# EAGLE design Joystick (EAGLE 9.6.0)
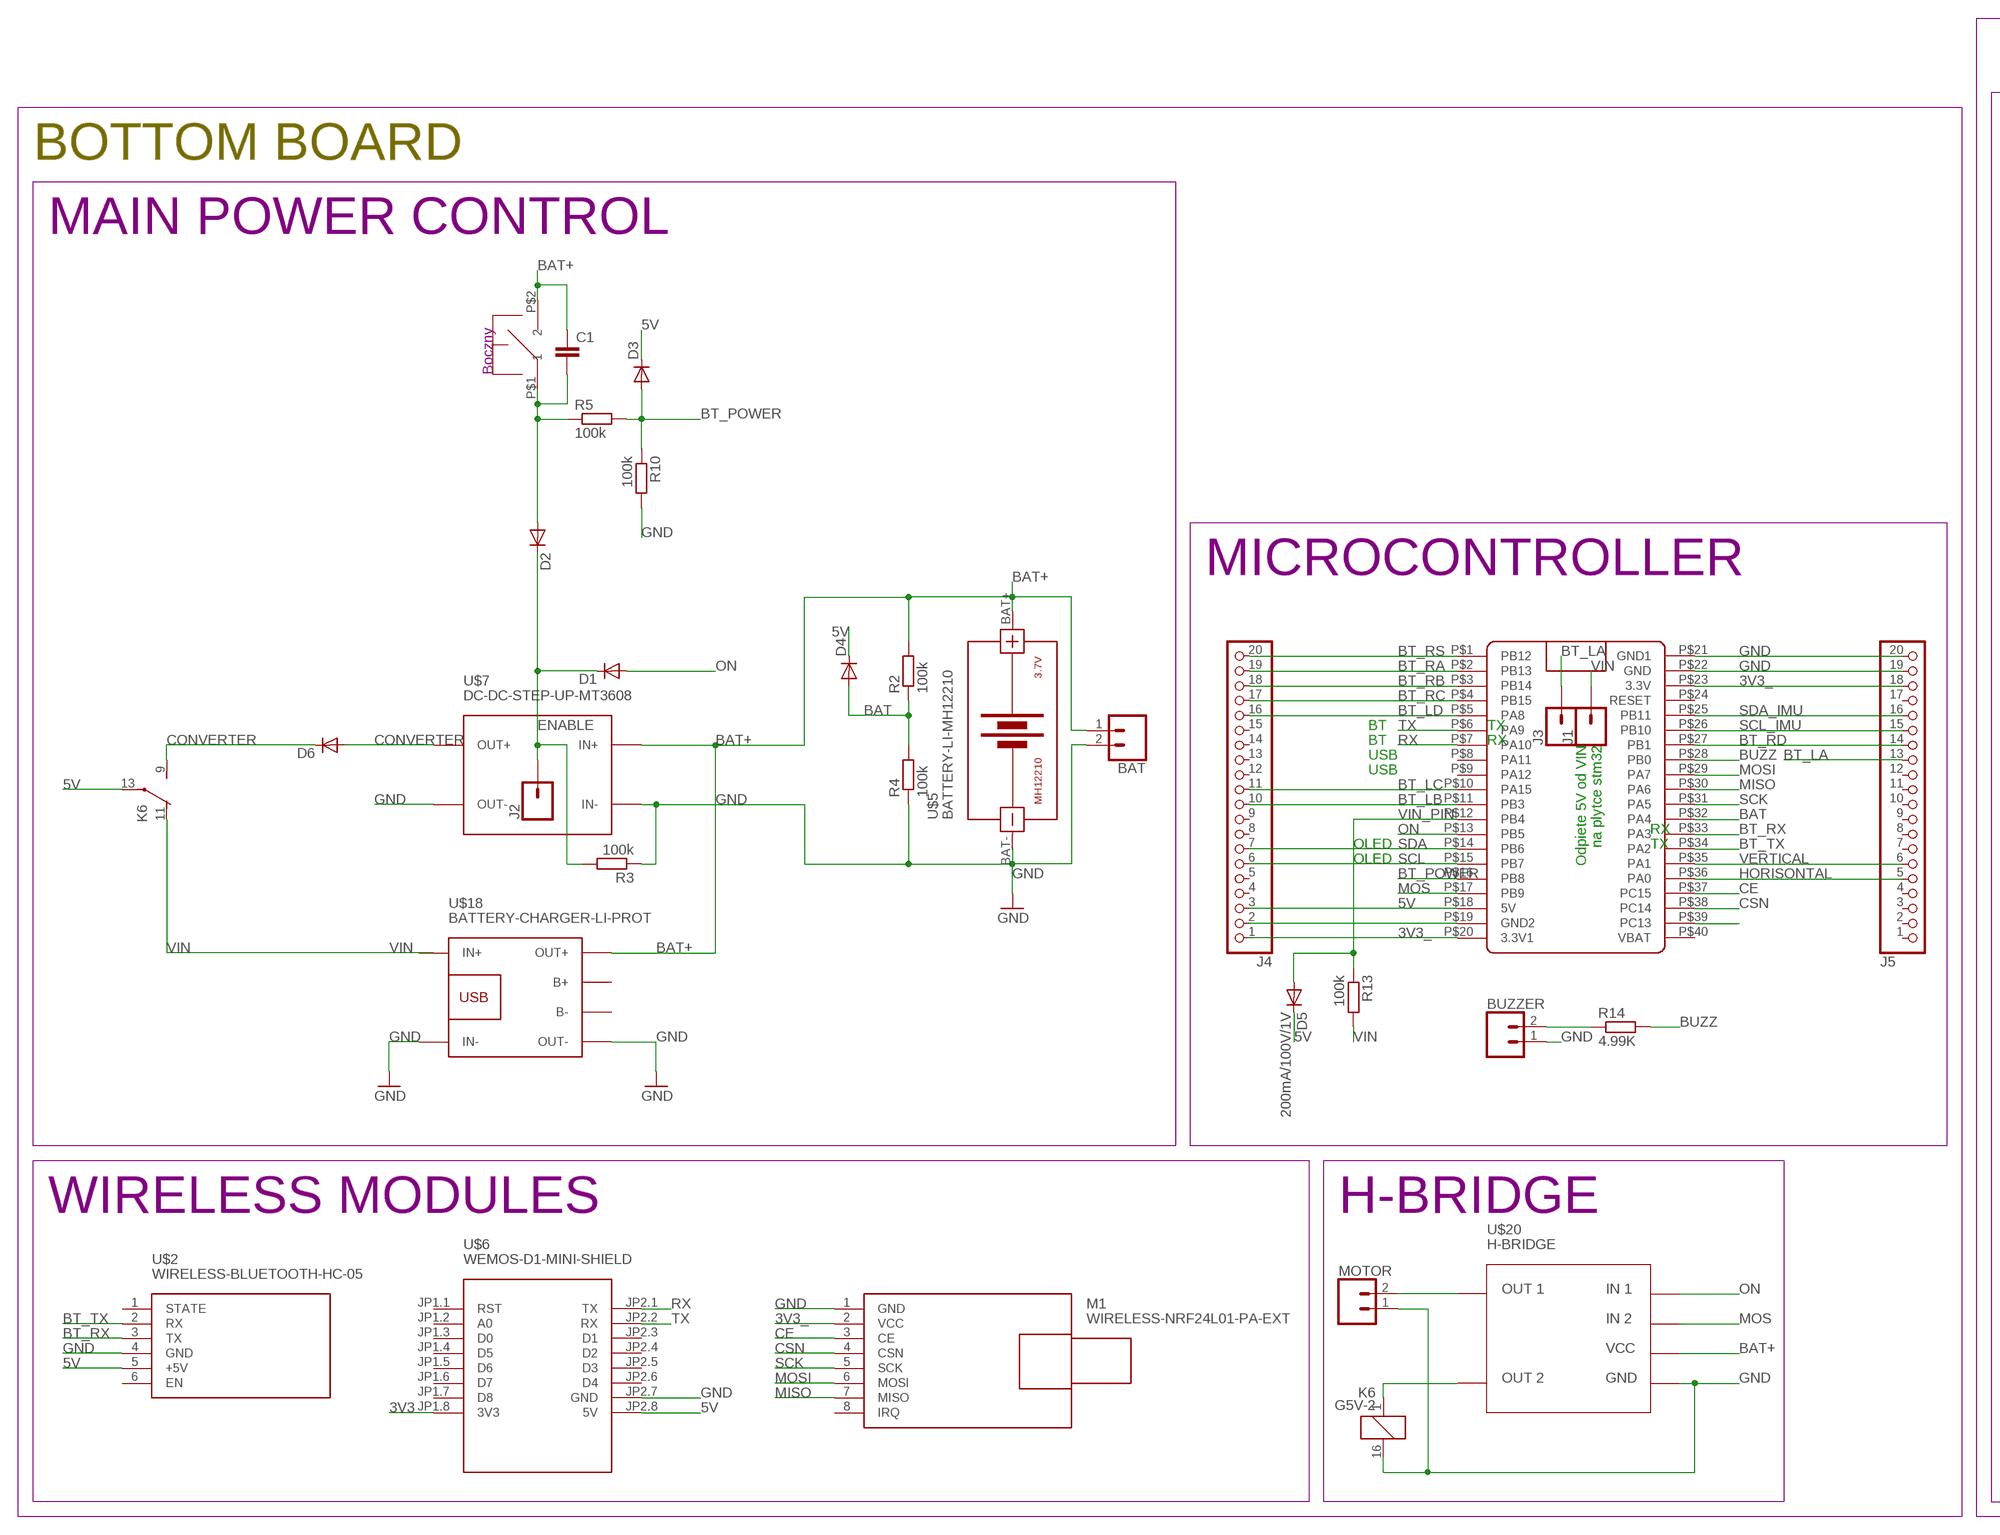
[diagram p0: schematic, sheet 1, part 1 of 2]
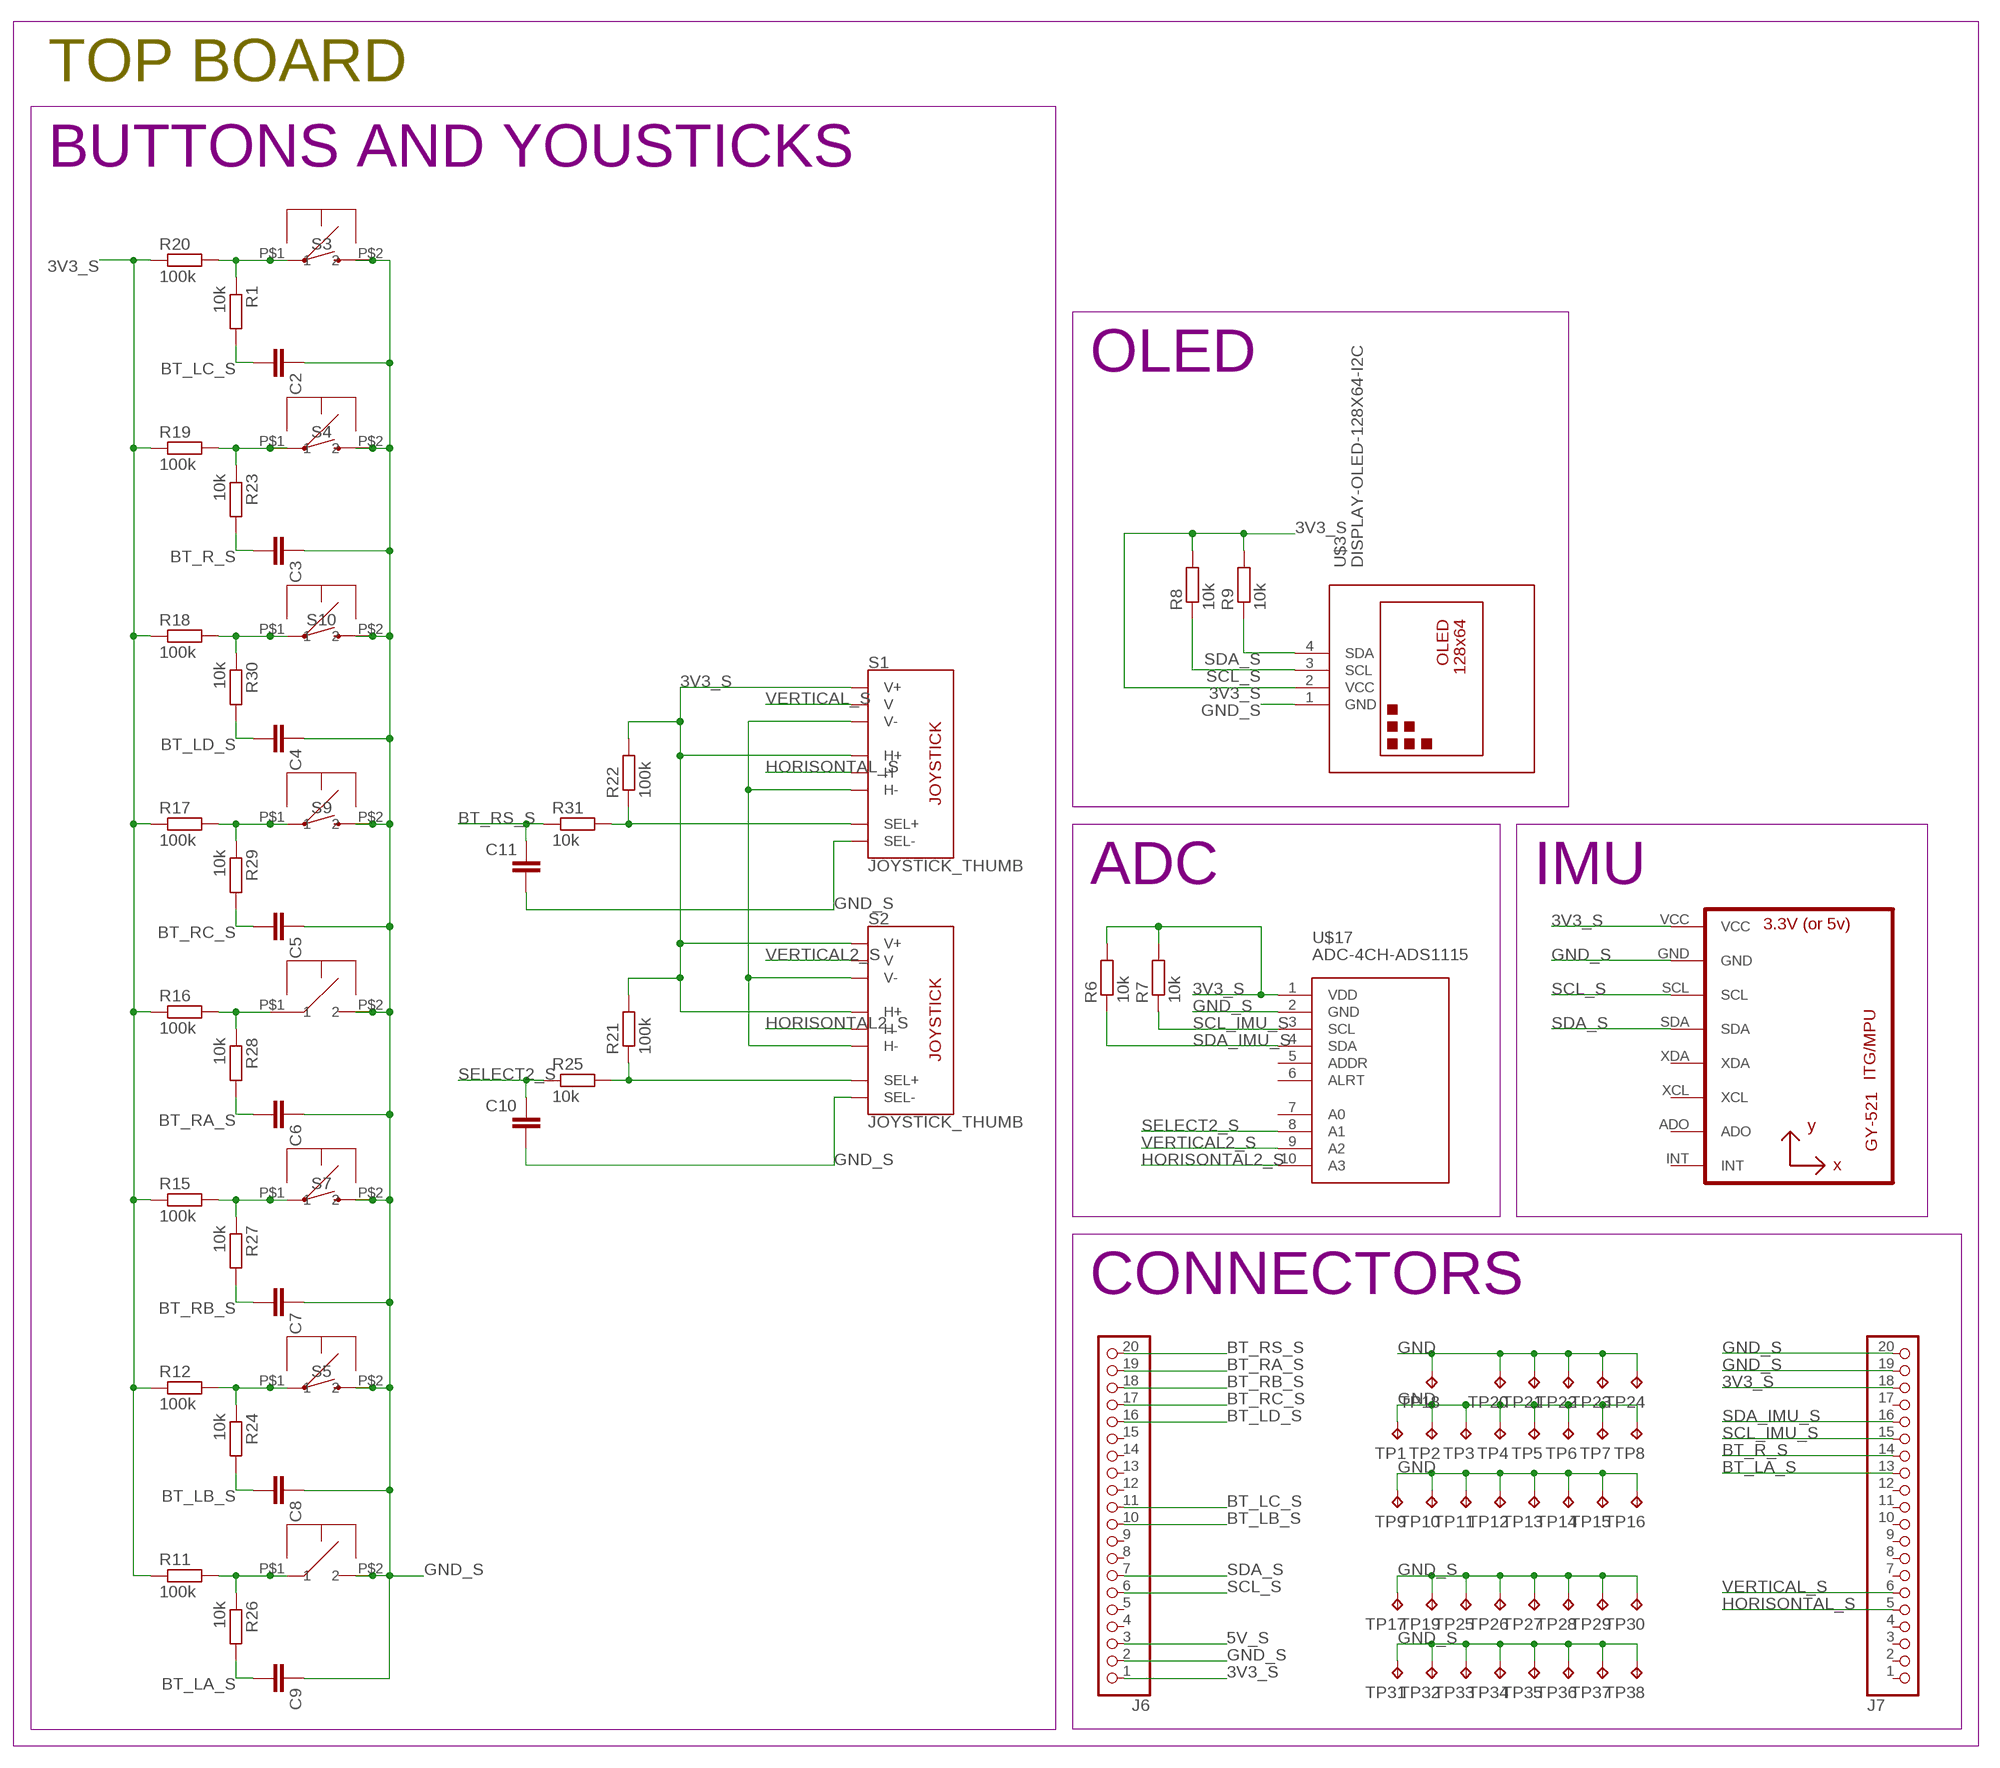
[diagram p1: schematic, sheet 1, part 2 of 2]

## Parts
BAT  CONN_02  [1X02]
BUZZER  CONN_02  [1X02]
C1  C-EUC1206  [C1206]
C2  C-EUC1206  [C1206]
C3  C-EUC1206  [C1206]
C4  C-EUC1206  [C1206]
C5  C-EUC1206  [C1206]
C6  C-EUC1206  [C1206]
C7  C-EUC1206  [C1206]
C8  C-EUC1206  [C1206]
C9  C-EUC1206  [C1206]
C10  C-EUC1206  [C1206]
C11  C-EUC1206  [C1206]
D1  200mA/100V/1V  DIODE-DO214AC  [DO214AC]
D2  200mA/100V/1V  DIODE-DO214AC  [DO214AC]
D3  200mA/100V/1V  DIODE-DO214AC  [DO214AC]
D4  200mA/100V/1V  DIODE-DO214AC  [DO214AC]
D5  200mA/100V/1V  DIODE-DO214AC  [DO214AC]
D6  200mA/100V/1V  DIODE-DO214AC  [DO214AC]
J1  CONN_01  [1X01]
J2  CONN_01  [1X01]
J3  CONN_01  [1X01]
J4  PINHD-1X20  [1X20]
J5  PINHD-1X20  [1X20]
J6  PINHD-1X20  [1X20]
J7  PINHD-1X20  [1X20]
K6  G5V-2  [G5V-2]
M1  WIRELESS-NRF24L01-PA-EXT  [WIRELESS-NRF24L01-PA-EXT]
MOTOR  CONN_02  [1X02]
R1  10k  R-EU_R0805  [R0805]
R2  100k  R-EU_R0805  [R0805]
R3  100k  R-EU_R0805  [R0805]
R4  100k  R-EU_R0805  [R0805]
R5  100k  R-EU_R0805  [R0805]
R6  10k  R-EU_R0805  [R0805]
R7  10k  R-EU_R0805  [R0805]
R8  10k  R-EU_R0805  [R0805]
R9  10k  R-EU_R0805  [R0805]
R10  100k  R-EU_R0805  [R0805]
R11  100k  R-EU_R0805  [R0805]
R12  100k  R-EU_R0805  [R0805]
R13  100k  R-EU_R0805  [R0805]
R14  4.99K  R-EU_R0805  [R0805]
R15  100k  R-EU_R0805  [R0805]
R16  100k  R-EU_R0805  [R0805]
R17  100k  R-EU_R0805  [R0805]
R18  100k  R-EU_R0805  [R0805]
R19  100k  R-EU_R0805  [R0805]
R20  100k  R-EU_R0805  [R0805]
R21  100k  R-EU_R0805  [R0805]
R22  100k  R-EU_R0805  [R0805]
R23  10k  R-EU_R0805  [R0805]
R24  10k  R-EU_R0805  [R0805]
R25  10k  R-EU_R0805  [R0805]
R26  10k  R-EU_R0805  [R0805]
R27  10k  R-EU_R0805  [R0805]
R28  10k  R-EU_R0805  [R0805]
R29  10k  R-EU_R0805  [R0805]
R30  10k  R-EU_R0805  [R0805]
R31  10k  R-EU_R0805  [R0805]
S1  JOYSTICK_THUMB  [JOYSTICK]
S2  JOYSTICK_THUMB  [JOYSTICK]
S3  MOMENTARY-SWITCH-SPST-PTH-12MM  [TACTILE_SWITCH_PTH_12MM]
S4  MOMENTARY-SWITCH-SPST-PTH-12MM  [TACTILE_SWITCH_PTH_12MM]
S5  MOMENTARY-SWITCH-SPST-PTH-12MM  [TACTILE_SWITCH_PTH_12MM]
S7  MOMENTARY-SWITCH-SPST-PTH-12MM  [TACTILE_SWITCH_PTH_12MM]
S9  MOMENTARY-SWITCH-SPST-PTH-12MM  [TACTILE_SWITCH_PTH_12MM]
S10  MOMENTARY-SWITCH-SPST-PTH-12MM  [TACTILE_SWITCH_PTH_12MM]
TP1  TPB1,27  [B1,27]
TP2  TPB1,27  [B1,27]
TP3  TPB1,27  [B1,27]
TP4  TPB1,27  [B1,27]
TP5  TPB1,27  [B1,27]
TP6  TPB1,27  [B1,27]
TP7  TPB1,27  [B1,27]
TP8  TPB1,27  [B1,27]
TP9  TPB1,27  [B1,27]
TP10  TPB1,27  [B1,27]
TP11  TPB1,27  [B1,27]
TP12  TPB1,27  [B1,27]
TP13  TPB1,27  [B1,27]
TP14  TPB1,27  [B1,27]
TP15  TPB1,27  [B1,27]
TP16  TPB1,27  [B1,27]
TP17  TPB1,27  [B1,27]
TP18  TPB1,27  [B1,27]
TP19  TPB1,27  [B1,27]
TP20  TPB1,27  [B1,27]
TP21  TPB1,27  [B1,27]
TP22  TPB1,27  [B1,27]
TP23  TPB1,27  [B1,27]
TP24  TPB1,27  [B1,27]
TP25  TPB1,27  [B1,27]
TP26  TPB1,27  [B1,27]
TP27  TPB1,27  [B1,27]
TP28  TPB1,27  [B1,27]
TP29  TPB1,27  [B1,27]
TP30  TPB1,27  [B1,27]
TP31  TPB1,27  [B1,27]
TP32  TPB1,27  [B1,27]
TP33  TPB1,27  [B1,27]
TP34  TPB1,27  [B1,27]
TP35  TPB1,27  [B1,27]
TP36  TPB1,27  [B1,27]
TP37  TPB1,27  [B1,27]
TP38  TPB1,27  [B1,27]
U1  GY-521MPU6050  [GY-521]
U$1  BLUE_PILL  [BLUE_PILL]
U$2  WIRELESS-BLUETOOTH-HC-05  [WIRELESS-BLUETOOTH-HC-05]
U$3  DISPLAY-OLED-128X64-I2C  [DISPLAY-OLED-128X64-I2C]
U$4  MOUSE_BT  [MOUSE_BT]
U$5  BATTERY-LI-MH12210  [BATTERY-LI-MH12210]
U$6  WEMOS-D1-MINI-SHIELD  [WEMOS-D1-MINI-SHIELD]
U$7  DC-DC-STEP-UP-MT3608  [DC-DC-STEP-UP-MT3608]
U$8  MOUSE_BT  [MOUSE_BT]
U$9  MOUSE_BT  [MOUSE_BT]
U$10  MOUSE_BT  [MOUSE_BT]
U$11  MOUSE_BT  [MOUSE_BT]
U$12  MOUSE_BT  [MOUSE_BT]
U$13  MOUSE_BT  [MOUSE_BT]
U$14  MOUSE_BT  [MOUSE_BT]
U$16  MOUSE_BT  [MOUSE_BT]
U$17  ADC-4CH-ADS1115  [ADC-4CH-ADS1115]
U$18  BATTERY-CHARGER-LI-PROT  [BATTERY-CHARGER-LI-PROT]

## Nets
3V3: U$6.JP1.8(3V3)
3V3_: J4.1 J5.18 M1.2(VCC) U$1.P$20(3.3V1) U$1.P$23(3.3V)
3V3_S: J6.1 J7.18 R6.2 R7.2 R8.2 R9.2 R11.1 R12.1 R15.1 R16.1 R17.1 R18.1 R19.1 R20.1 R21.2 R22.2 S1.H1(H+) S1.V1(V+) S2.H1(H+) S2.V1(V+) U1.VCC U$3.2(VCC) U$17.1(VDD)
5V: D3.C D4.C D5.C J4.3 K6.13(2:P) U$1.P$18(5V) U$2.5(+5V) U$6.JP2.8(5V)
5V_S: J6.3
ASD: BUZZER.2 R14.1
BAT: D4.A R2.1 R4.2 U$1.P$32(PA4)
BAT+: BAT.1 C1.1 R2.2 U$5.BAT+ U$7.IN+ U$8.P$2 U$18.OUT+
BT_LA: J3.1 J5.13
BT_LA_S: C9.2 J7.13 R26.2
BT_LB: J4.10 U$1.P$11(PB3)
BT_LB_S: C8.2 J6.10 R24.2
BT_LC: J4.11 U$1.P$10(PA15)
BT_LC_S: C2.2 J6.11 R1.2
BT_LD: J4.16 U$1.P$5(PA8)
BT_LD_S: C4.2 J6.16 R30.2
BT_POWER: D3.A R5.2 R10.1 U$1.P$16(PB8)
BT_R_S: C3.2 J7.14 R23.2
BT_RA: J4.19 U$1.P$2(PB13)
BT_RA_S: C6.2 J6.19 R28.2
BT_RB: J4.18 U$1.P$3(PB14)
BT_RB_S: C7.2 J6.18 R27.2
BT_RC: J4.17 U$1.P$4(PB15)
BT_RC_S: C5.2 J6.17 R29.2
BT_RD: J5.14 U$1.P$27(PB1)
BT_RS: J4.20 U$1.P$1(PB12)
BT_RS_S: C11.1 J6.20 R31.1
BT_RX: U$1.P$33(PA3) U$2.3(TX)
BT_TX: U$1.P$34(PA2) U$2.2(RX)
BUTTON: C1.2 D2.A R5.1 U$8.P$1
BUZZ: R14.2 U$1.P$28(PB0)
CE: M1.3(CE) U$1.P$37(PC15)
CONVERTER: D6.C K6.9(2:S)
CSN: M1.4(CSN) U$1.P$38(PC14)
ENABLE: D1.C D2.C J2.1 R3.2
GGJHGJ: U$1.P$39(PC13)
GND: BAT.2 BUZZER.1 J4.2 J5.19 J5.20 K6.16 M1.1(GND) MOTOR.1 R3.1 R4.1 R10.2 TP1.TP TP2.TP TP3.TP TP4.TP TP5.TP TP6.TP TP7.TP TP8.TP TP9.TP TP10.TP TP11.TP TP12.TP TP13.TP TP14.TP TP15.TP TP16.TP TP18.TP TP20.TP TP21.TP TP22.TP TP23.TP TP24.TP U$1.P$19(GND2) U$1.P$21(GND1) U$1.P$22(GND) U$2.4(GND) U$5.BAT- U$6.JP2.7(GND) U$7.IN- U$7.OUT- U$18.IN- U$18.OUT-
GND_S: C2.1 C3.1 C4.1 C5.1 C6.1 C7.1 C8.1 C9.1 C10.2 C11.2 J6.2 J7.19 J7.20 S1.B2A(SEL-) S1.H3(H-) S1.V3(V-) S2.B2A(SEL-) S2.H3(H-) S2.V3(V-) S3.3 S4.3 S5.3 S7.3 S9.3 S10.3 TP17.TP TP19.TP TP25.TP TP26.TP TP27.TP TP28.TP TP29.TP TP30.TP TP31.TP TP32.TP TP33.TP TP34.TP TP35.TP TP36.TP TP37.TP TP38.TP U1.GND U$3.1(GND) U$4.P$2 U$9.P$2 U$10.P$2 U$11.P$2 U$12.P$2 U$13.P$2 U$14.P$2 U$16.P$2 U$17.2(GND)
HORISONTAL: J5.5 U$1.P$36(PA0)
HORISONTAL2_S: S2.H2(H) U$17.10(A3)
HORISONTAL_S: J7.5 S1.H2(H)
MISO: M1.7(MISO) U$1.P$30(PA6)
MOS: U$1.P$17(PB9)
MOSI: M1.6(MOSI) U$1.P$29(PA7)
N$1: D6.A U$7.OUT+
N$2: R1.1 R20.2 S3.1 U$10.P$1
N$3: R19.2 R23.1 S4.1 U$4.P$1
N$4: MOTOR.2
N$5: R21.1 R25.2 S2.B1A(SEL+)
N$6: R12.2 R24.1 S5.1 U$11.P$1
N$7: R11.2 R26.1 U$9.P$1
N$8: R18.2 R30.1 S10.1 U$16.P$1
N$9: R17.2 R29.1 S9.1 U$14.P$1
N$10: R16.2 R28.1 U$12.P$1
N$11: R15.2 R27.1 S7.1 U$13.P$1
N$12: R22.1 R31.2 S1.B1A(SEL+)
N$13: K6.1
ON: D1.A U$1.P$13(PB5)
RX: U$1.P$7(PA10) U$6.JP2.1(TX)
SCK: M1.5(SCK) U$1.P$31(PA5)
SCL: J4.6 U$1.P$15(PB7)
SCL_IMU: J5.15 U$1.P$26(PB10)
SCL_IMU_S: J7.15 R7.1 U$17.3(SCL)
SCL_S: J6.6 R8.1 U1.SCL U$3.3(SCL)
SDA: J4.7 U$1.P$14(PB6)
SDA_IMU: J5.16 U$1.P$25(PB11)
SDA_IMU_S: J7.16 R6.1 U$17.4(SDA)
SDA_S: J6.7 R9.1 U1.SDA U$3.4(SDA)
SELECT2_S: C10.1 R25.1 U$17.8(A1)
TX: U$1.P$6(PA9) U$6.JP2.2(RX)
VERTICAL: J5.6 U$1.P$35(PA1)
VERTICAL2_S: S2.V2(V) U$17.9(A2)
VERTICAL_S: J7.6 S1.V2(V)
VIN: J1.1 K6.11(2:O) R13.2 U$18.IN+
VIN_PIN: D5.A R13.1 U$1.P$12(PB4)
Unconnected: J4.4 J4.5 J4.8 J4.9 J4.12 J4.13 J4.14 J4.15 J5.1 J5.2 J5.3 J5.4 J5.7 J5.8 J5.9 J5.10 J5.11 J5.12 J5.17 J6.4 J6.5 J6.8 J6.9 J6.12 J6.13 J6.14 J6.15 J7.1 J7.2 J7.3 J7.4 J7.7 J7.8 J7.9 J7.10 J7.11 J7.12 J7.17 K6.4(1:P) K6.6(1:O) K6.8(1:S) M1.8(IRQ) U1.ADO U1.INT U1.XCL U1.XDA U$1.P$8(PA11) U$1.P$9(PA12) U$1.P$24(RESET) U$1.P$40(VBAT) U$2.1(STATE) U$2.6(EN) U$6.JP1.1(RST) U$6.JP1.2(A0) U$6.JP1.3(D0) U$6.JP1.4(D5) U$6.JP1.5(D6) U$6.JP1.6(D7) U$6.JP1.7(D8) U$6.JP2.3(D1) U$6.JP2.4(D2) U$6.JP2.5(D3) U$6.JP2.6(D4) U$17.5(ADDR) U$17.6(ALRT) U$17.7(A0) U$18.B+ U$18.B-

## Notes on the sheet
- TOP BOARD
- BOTTOM BOARD | BUTTONS AND YOUSTICKS
- MAIN POWER CONTROL
- OLED
- Boczny
- MICROCONTROLLER
- BT | TX | ADC | IMU
- BT | RX
- Odpiete 5V od VIN
  na plytce stm32
- USB
- USB
- RX
- OLED | TX
- OLED
- CONNECTORS
- WIRELESS MODULES | H-BRIDGE
- U$20
- H-BRIDGE
- OUT 1 | IN 1
- IN 2
- VCC
- OUT 2 | GND

## Library data of the parts
BAT BUZZER MOTOR = SparkFun-Connectors:CONN_02: Multi connection point. Often used as Generic Header-pin footprint for 0.1 inch spaced/style header connections On any of the 0.1 inch spaced packages, you can populate with these: Break Away Headers - Straight <https://www.sparkfun.com/products/116> (PRT-00116) Break Away Male Headers - Right Angle <https://www.sparkfun.com/products/553> (PRT-00553) Female Headers <https://www.sparkfun.com/products/115> (PRT-00115) Break Away Headers - Machine Pin <https://www.sparkfun.com/products/117> (PRT-00117) Break Away Female Headers - Swiss Machine Pin <https://www.sparkfun.com/products/743> (PRT-00743) For SCREWTERMINALS and SPRING TERMINALS visit here: Screw Terimnals on SparkFun.com <https://www.sparkfun.com/search/results?term=Screw+Terminals> (5mm/3.5mm/2.54mm spacing) This device is also useful as a general connection point to wire up your design to another part of your project. Our various solder wires solder well into these plated through hole pads. Hook-Up Wire - Assortment (Stranded, 22 AWG) <https://www.sparkfun.com/products/11375> (PRT-11375) Hook-Up Wire - Assortment (Solid Core, 22 AWG) <https://www.sparkfun.com/products/11367> (PRT-11367) View the entire wire category on our website here <https://www.sparkfun.com/categories/141> Special notes: Molex polarized connector foot print use with: PRT-08233 with associated crimp pins and housings. 2.54_SCREWTERM for use with PRT-10571. 3.5mm Screw Terminal footprints for PRT-08084 5mm Screw Terminal footprints for use with PRT-08432
C1-C11 = rcl:C-EU: CAPACITOR, European symbol; SPICEPREFIX: C
D1-D6 = diode:DIODE-: DIODE
J1-J3 = SparkFun-Connectors:CONN_01: Single connection point. Often used as Generic Header-pin footprint for 0.1 inch spaced/style header connections On any of the 0.1 inch spaced packages, you can populate with these: Break Away Headers - Straight <https://www.sparkfun.com/products/116> (PRT-00116) Break Away Male Headers - Right Angle <https://www.sparkfun.com/products/553> (PRT-00553) Female Headers <https://www.sparkfun.com/products/115> (PRT-00115) Break Away Headers - Machine Pin <https://www.sparkfun.com/products/117> (PRT-00117) Break Away Female Headers - Swiss Machine Pin <https://www.sparkfun.com/products/743> (PRT-00743) This device is also useful as a general connection point to wire up your design to another part of your project. Our various solder wires solder well into these plated through hole pads. Hook-Up Wire - Assortment (Stranded, 22 AWG) <https://www.sparkfun.com/products/11375> (PRT-11375) Hook-Up Wire - Assortment (Solid Core, 22 AWG) <https://www.sparkfun.com/products/11367> (PRT-11367) View the entire wire category on our website here <https://www.sparkfun.com/categories/141> Special notes: SMTSO-256-ET is a "flush mount" nut for a 4-40 screw. We mostly use this on specialty testbeds; it is a nice way to connect hardware to your PCB at an adjustable hieght. Also note, the SNAP packages are for using a snappable style connector. We sell a baggie of snaps and they are also used on two LilyPad designs: Snap Assortment - 30 pack (male and female) <https://www.sparkfun.com/products/11347> (DEV-11347) LilyPad Arduino SimpleSnap <https://www.sparkfun.com/products/10941> (DEV-10941) LilyPad SimpleSnap Protoboard <https://www.sparkfun.com/products/10940> (DEV-10940)
J4-J7 = adafruit:PINHD-1X20: PIN HEADER
K6 = relay:G5V-2: OMRON PCB Relay Source: http://www.omron.com/ecb/products/pdf/en-g5v2.pdf; MPN: G5V-2 5DC; OC_FARNELL: 9949488; OC_NEWARK: 78K5703
M1 = diy-modules:WIRELESS-NRF24L01-PA-EXT: 2.4 GHz Wireless Module based on NRF24L01 chip with preamplifier and external antenna Click here to find device on ebay.com <http://www.ebay.com/sch/nrf24l01+pa+lna+sma>
R1-R31 = rcl:R-EU_: RESISTOR, European symbol; SPICEPREFIX: R
S1 S2 = SparkFun-Switches:JOYSTICK_THUMB: Analog Thumb Joystick This is a joystick very similar to the ‘analog’ joysticks on PS2 (PlayStation 2) controllers. Directional movements are simply two potentiometers - one for each axis. Pots are ~10k each. This joystick also has a select button that is actuated when the joystick is pressed down. SparkFun Products Thumb Joystick <https://www.sparkfun.com/products/9032> (COM-09032) SparkFun Thumb Joystick Breakout <https://www.sparkfun.com/products/9110> (BOB-09110) SparkFun Joystick Shield Kit <https://www.sparkfun.com/products/9760> (DEV-09760); PROD_ID: COMP-09744; SF_SKU: COM-09032
S3-S5 S7 S9 S10 = SparkFun-Switches:MOMENTARY-SWITCH-SPST: Momentary Switch (Pushbutton) - SPST Normally-open (NO) SPST momentary switches (buttons, pushbuttons). Variants PTH-12MM - 12mm square, through-hole Momentary Pushbutton Switch - 12mm Square <https://www.sparkfun.com/products/9190> (COM-09190) PTH-6.0MM, PTH-6.0MM-KIT - 6.0mm square, through-hole Mini Pushbutton Switch <https://www.sparkfun.com/products/97> (COM-00097) KIT package intended for soldering kit's - only one side of pads' copper is exposed. PTH-RIGHT-ANGLE-KIT - Right-angle, through-hole Right Angle Tactile Button <https://www.sparkfun.com/products/10791> - Used on SparkFun BigTime Watch Kit <https://www.sparkfun.com/products/11734> SMD-12MM - 12mm square, surface-mount Tactile Button - SMD (12mm) <https://www.sparkfun.com/products/12993> (COM-12993) Used on SparkFun PicoBoard <https://www.sparkfun.com/products/11888> SMD-4.5MM - 4.5mm Square Trackball Switch Used on SparkFun Blackberry Trackballer Breakout <https://www.sparkfun.com/products/13169> SMD-4.6MMX2.8MM - 4.60mm x 2.80mm, surface mount Used on SparkFun SAMD21 Mini Breakout <https://www.sparkfun.com/products/13664> SMD-5.2MM, SMD-5.2-REDUNDANT - 5.2mm square, surface-mount Mini Pushbutton Switch - SMD <https://www.sparkfun.com/products/8720> (COM-08720) Used on Arduino Pro Mini <https://www.sparkfun.com/products/11114> REDUNDANT package connects both switch circuits together SMD-6.0X3.5MM - 6.0 x 3.5mm, surface mount Momentary Reset Switch SMD <https://www.sparkfun.com/products/8229> (COM-08229) SMD-6.2MM-TALL - 6.2mm square, surface mount Tactile Button - SMD (6mm) <https://www.sparkfun.com/products/12992> Used on SparkFun Digital Sandbox <https://www.sparkfun.com/products/12651> SMD-RIGHT-ANGLE - Right-angle, surface mount Used on SparkFun Block for Intel® Edison - Arduino <https://www.sparkfun.com/products/13036>; PROD_ID: SWCH-09185; SF_SKU: COM-09190
TP1-TP38 = testpad:TP: Test pad
U1 = gy-521:GY-521
U$1 = BluePill:BLUE_PILL
U$2 = diy-modules:WIRELESS-BLUETOOTH-HC-05: Bluetooth Transceiver Module based on HC-05 board Tutorial is available here: https://arduino-info.wikispaces.com/BlueTooth-HC05-HC06-Modules-How-To Click here to find device on ebay.com <http://www.ebay.com/sch/hc-05+module+rs232>
U$3 = diy-modules:DISPLAY-OLED-128X64-I2C: 128x64 Dot Matrix OLED Module based on SSD1306 chip Variant with I2C interface More details available here: http://www.instructables.com/id/Monochrome-096-i2c-OLED-display-with-arduino-SSD13/ SSD1306 datasheet: https://cdn-shop.adafruit.com/datasheets/SSD1306.pdf Click here to find device on ebay.com <http://www.ebay.com/sch/oled+display+128x64+iic> Note: There are two variants: I2C and SPI. Search for the proper version.
U$4 U$8-U$14 U$16 = MOUSE_BT:MOUSE_BT
U$5 = diy-modules:BATTERY-LI-MH12210: Lithium-Ion MH12210 Rechargeable Battery Panasonic NCR18650PF battery datasheet available here: https://industrial.panasonic.com/cdbs/www-data/pdf2/ACI4000/ACI4000C12.pdf Click here to find device on ebay.com <http://www.ebay.com/sch/ncr18650b+battery>
U$6 = diy-modules:WEMOS-D1-MINI-SHIELD: Template for WEMOS D1 mini compatible shields NOTICE: This is a template only. You can use it as a base to create symbols for WEMOS D1 mini compatible shields. Official list of available shields can be found here: https://www.wemos.cc/D1-mini-Shields
U$7 = diy-modules:DC-DC-STEP-UP-MT3608: DC/DC Step-Up Regulator based on MT3608 chip MT3608 datasheet available here: https://www.olimex.com/Products/Breadboarding/BB-PWR-3608/resources/MT3608.pdf Click here to find device on ebay.com <http://www.ebay.com/sch/mt3608+module>
U$17 = diy-modules:ADC-4CH-ADS1115: 4 Channel 16-Bit Analog-to-Digital Converter based on ADS1115 chip Arduino ADS1115 Getting Started Tutorial is available here: http://henrysbench.capnfatz.com/henrys-bench/arduino-voltage-measurements/arduino-ads1115-module-getting-started-tutorial/ ADS1115 datasheet is available here: http://www.ti.com/lit/ds/symlink/ads1115.pdf Click here to find device on ebay.com <http://www.ebay.com/sch/ads1115+module>
U$18 = diy-modules:BATTERY-CHARGER-LI-PROT: Lithium Battery 5V Charger with protection circuit More details available here: http://www.instructables.com/id/DIY-Lithium-ion-Battery-Charger/step4/TP4056-based-lithium-ion-battery-charger-module/ Click here to find device on ebay.com <http://www.ebay.com/sch/tp4056+charger+usb+protection>

## Board
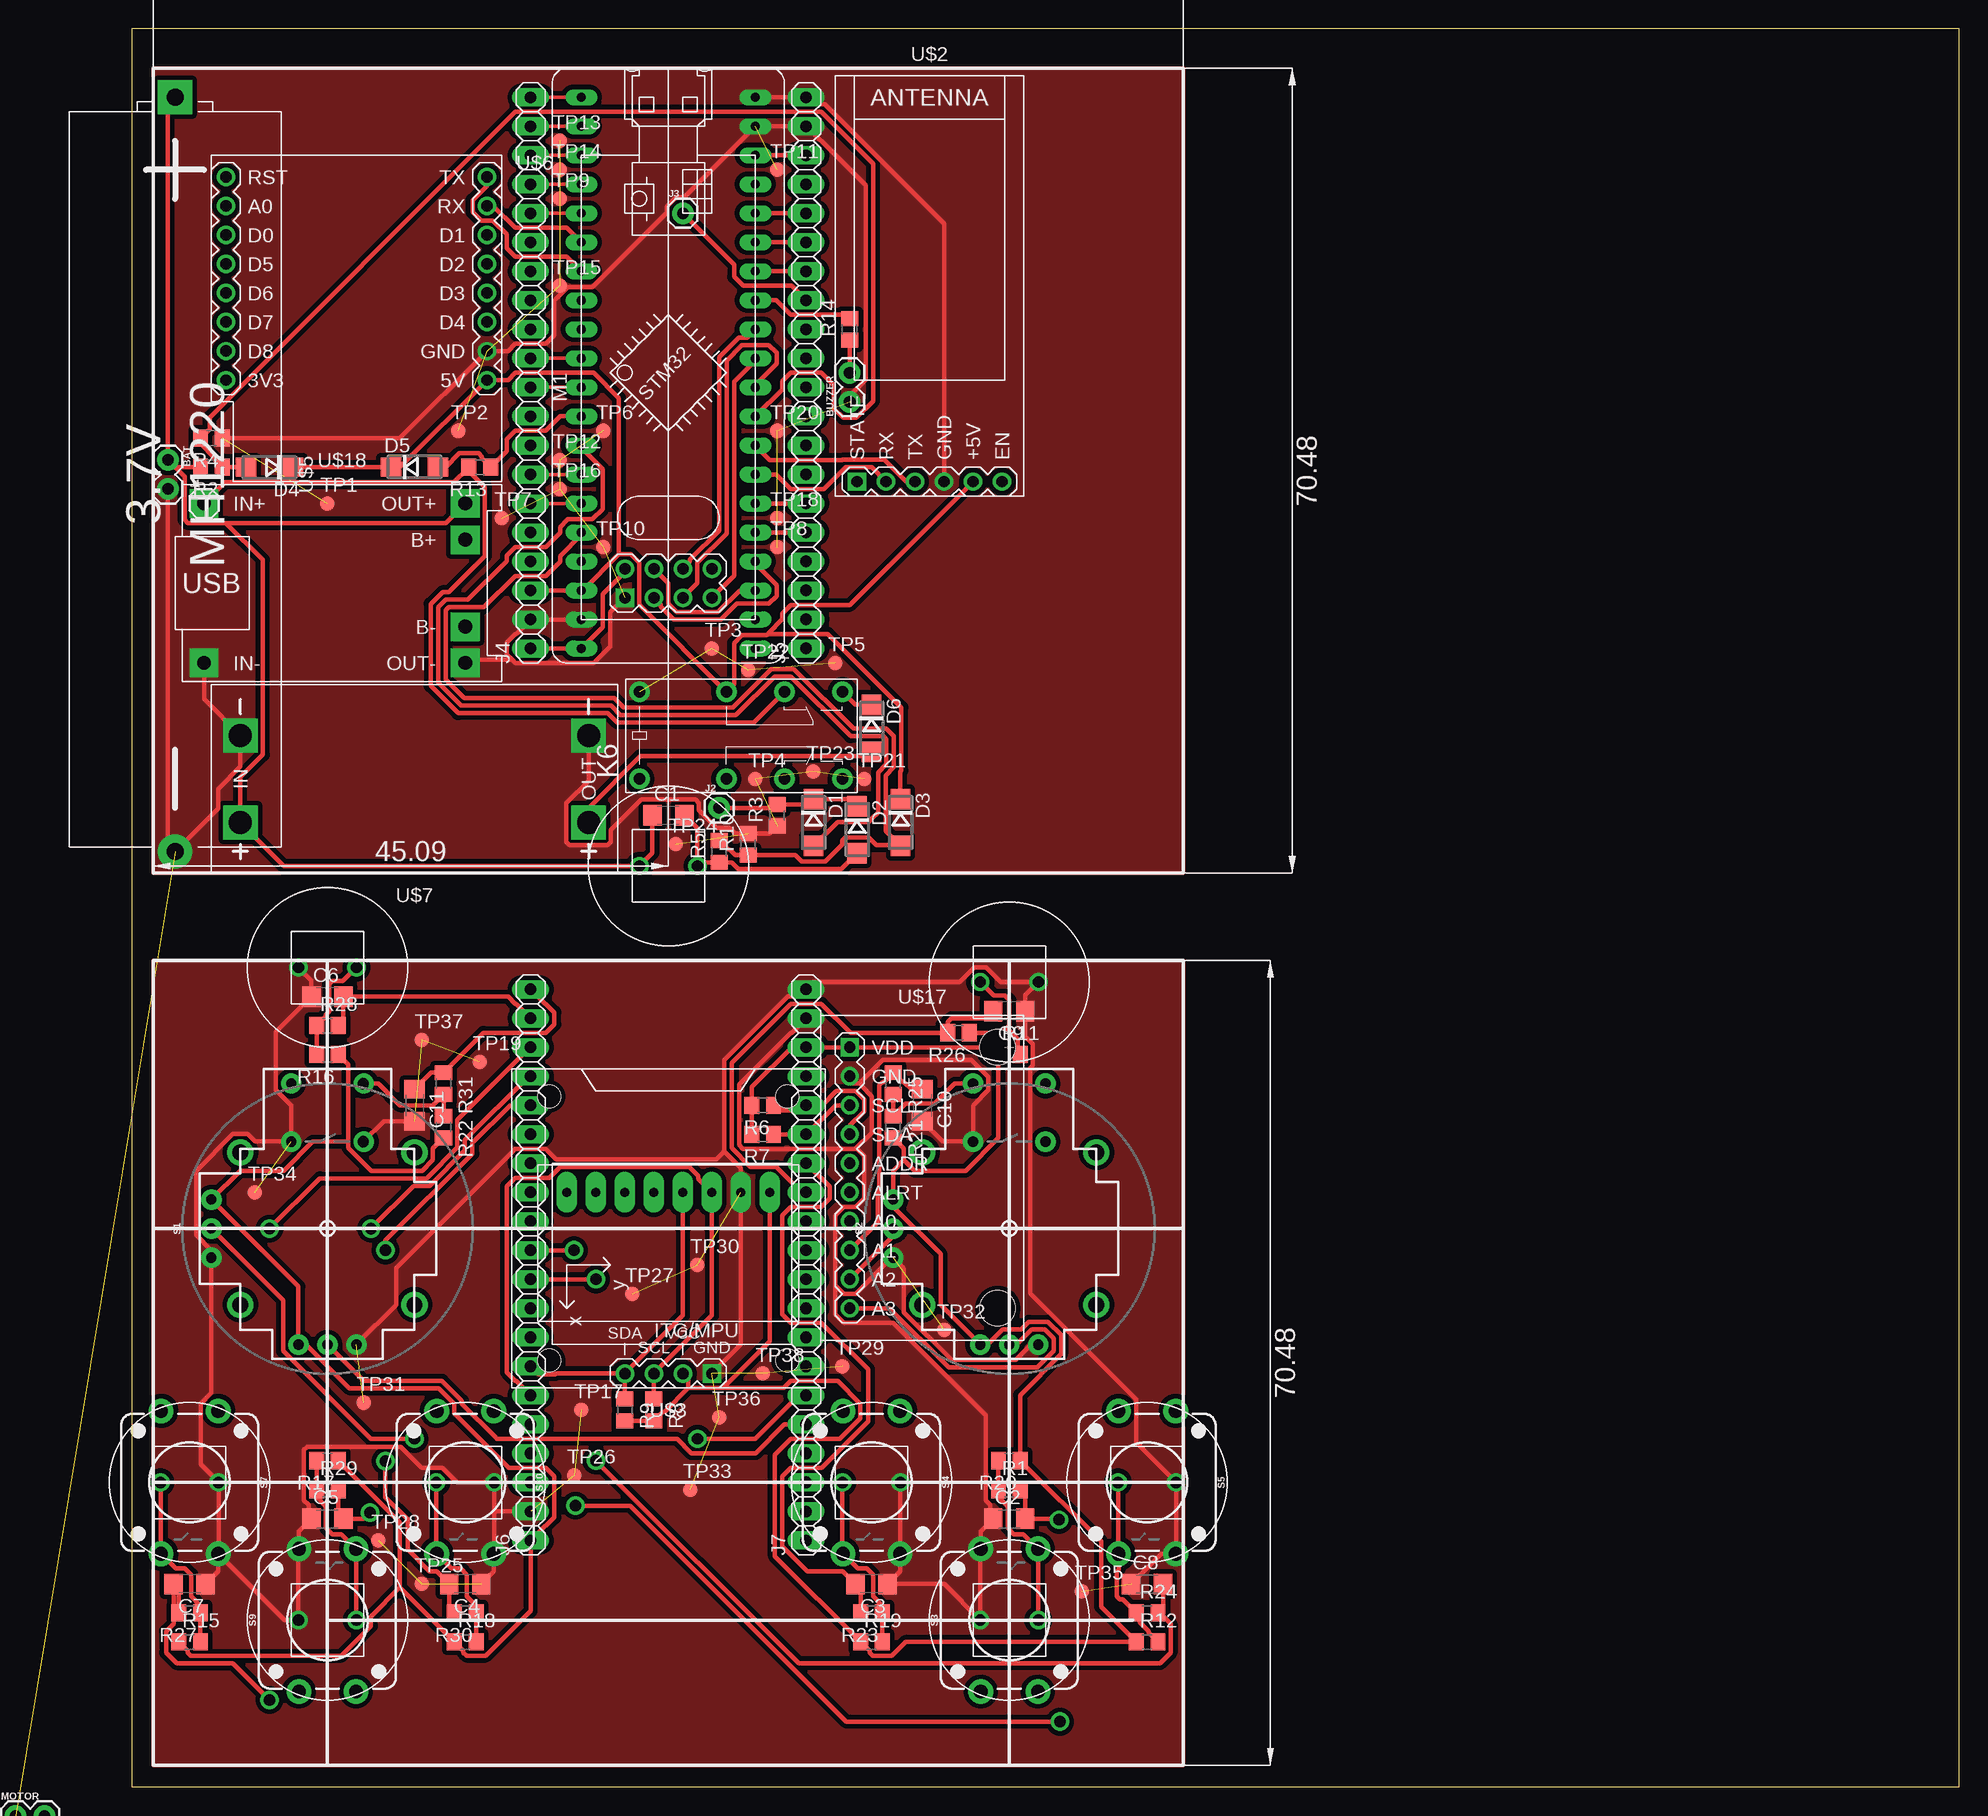
[diagram p2: board, top side]
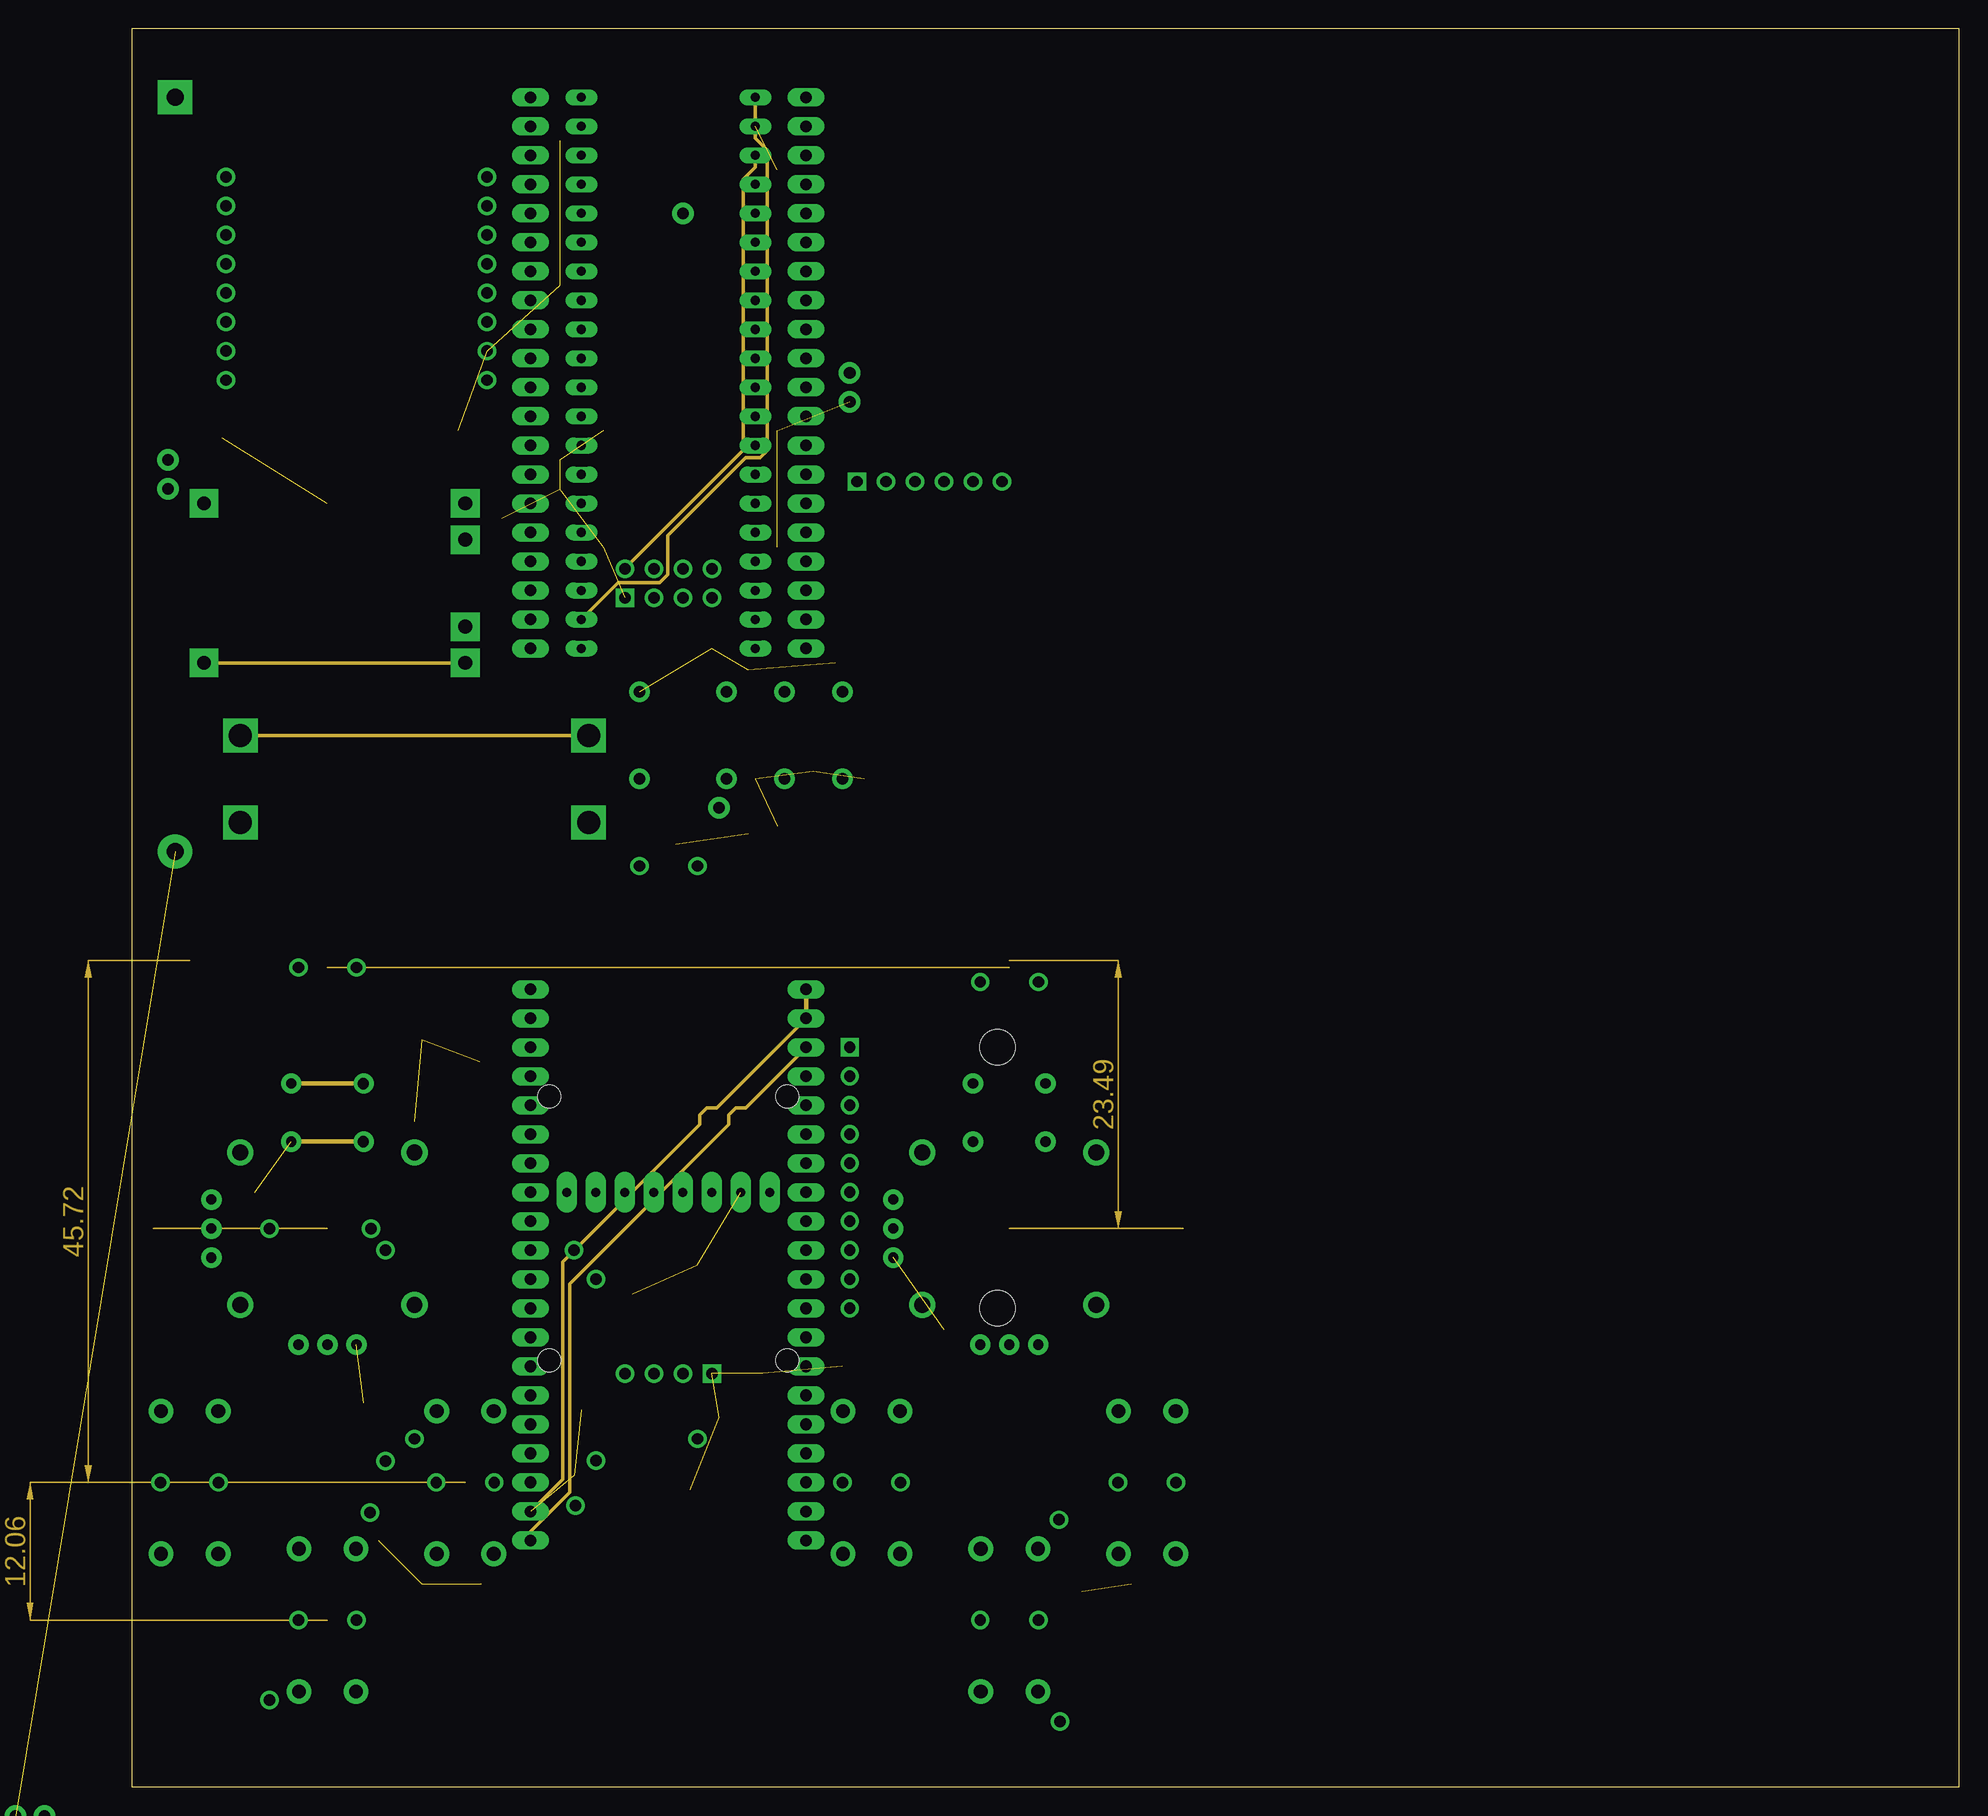
[diagram p3: board, inner layer Route2]
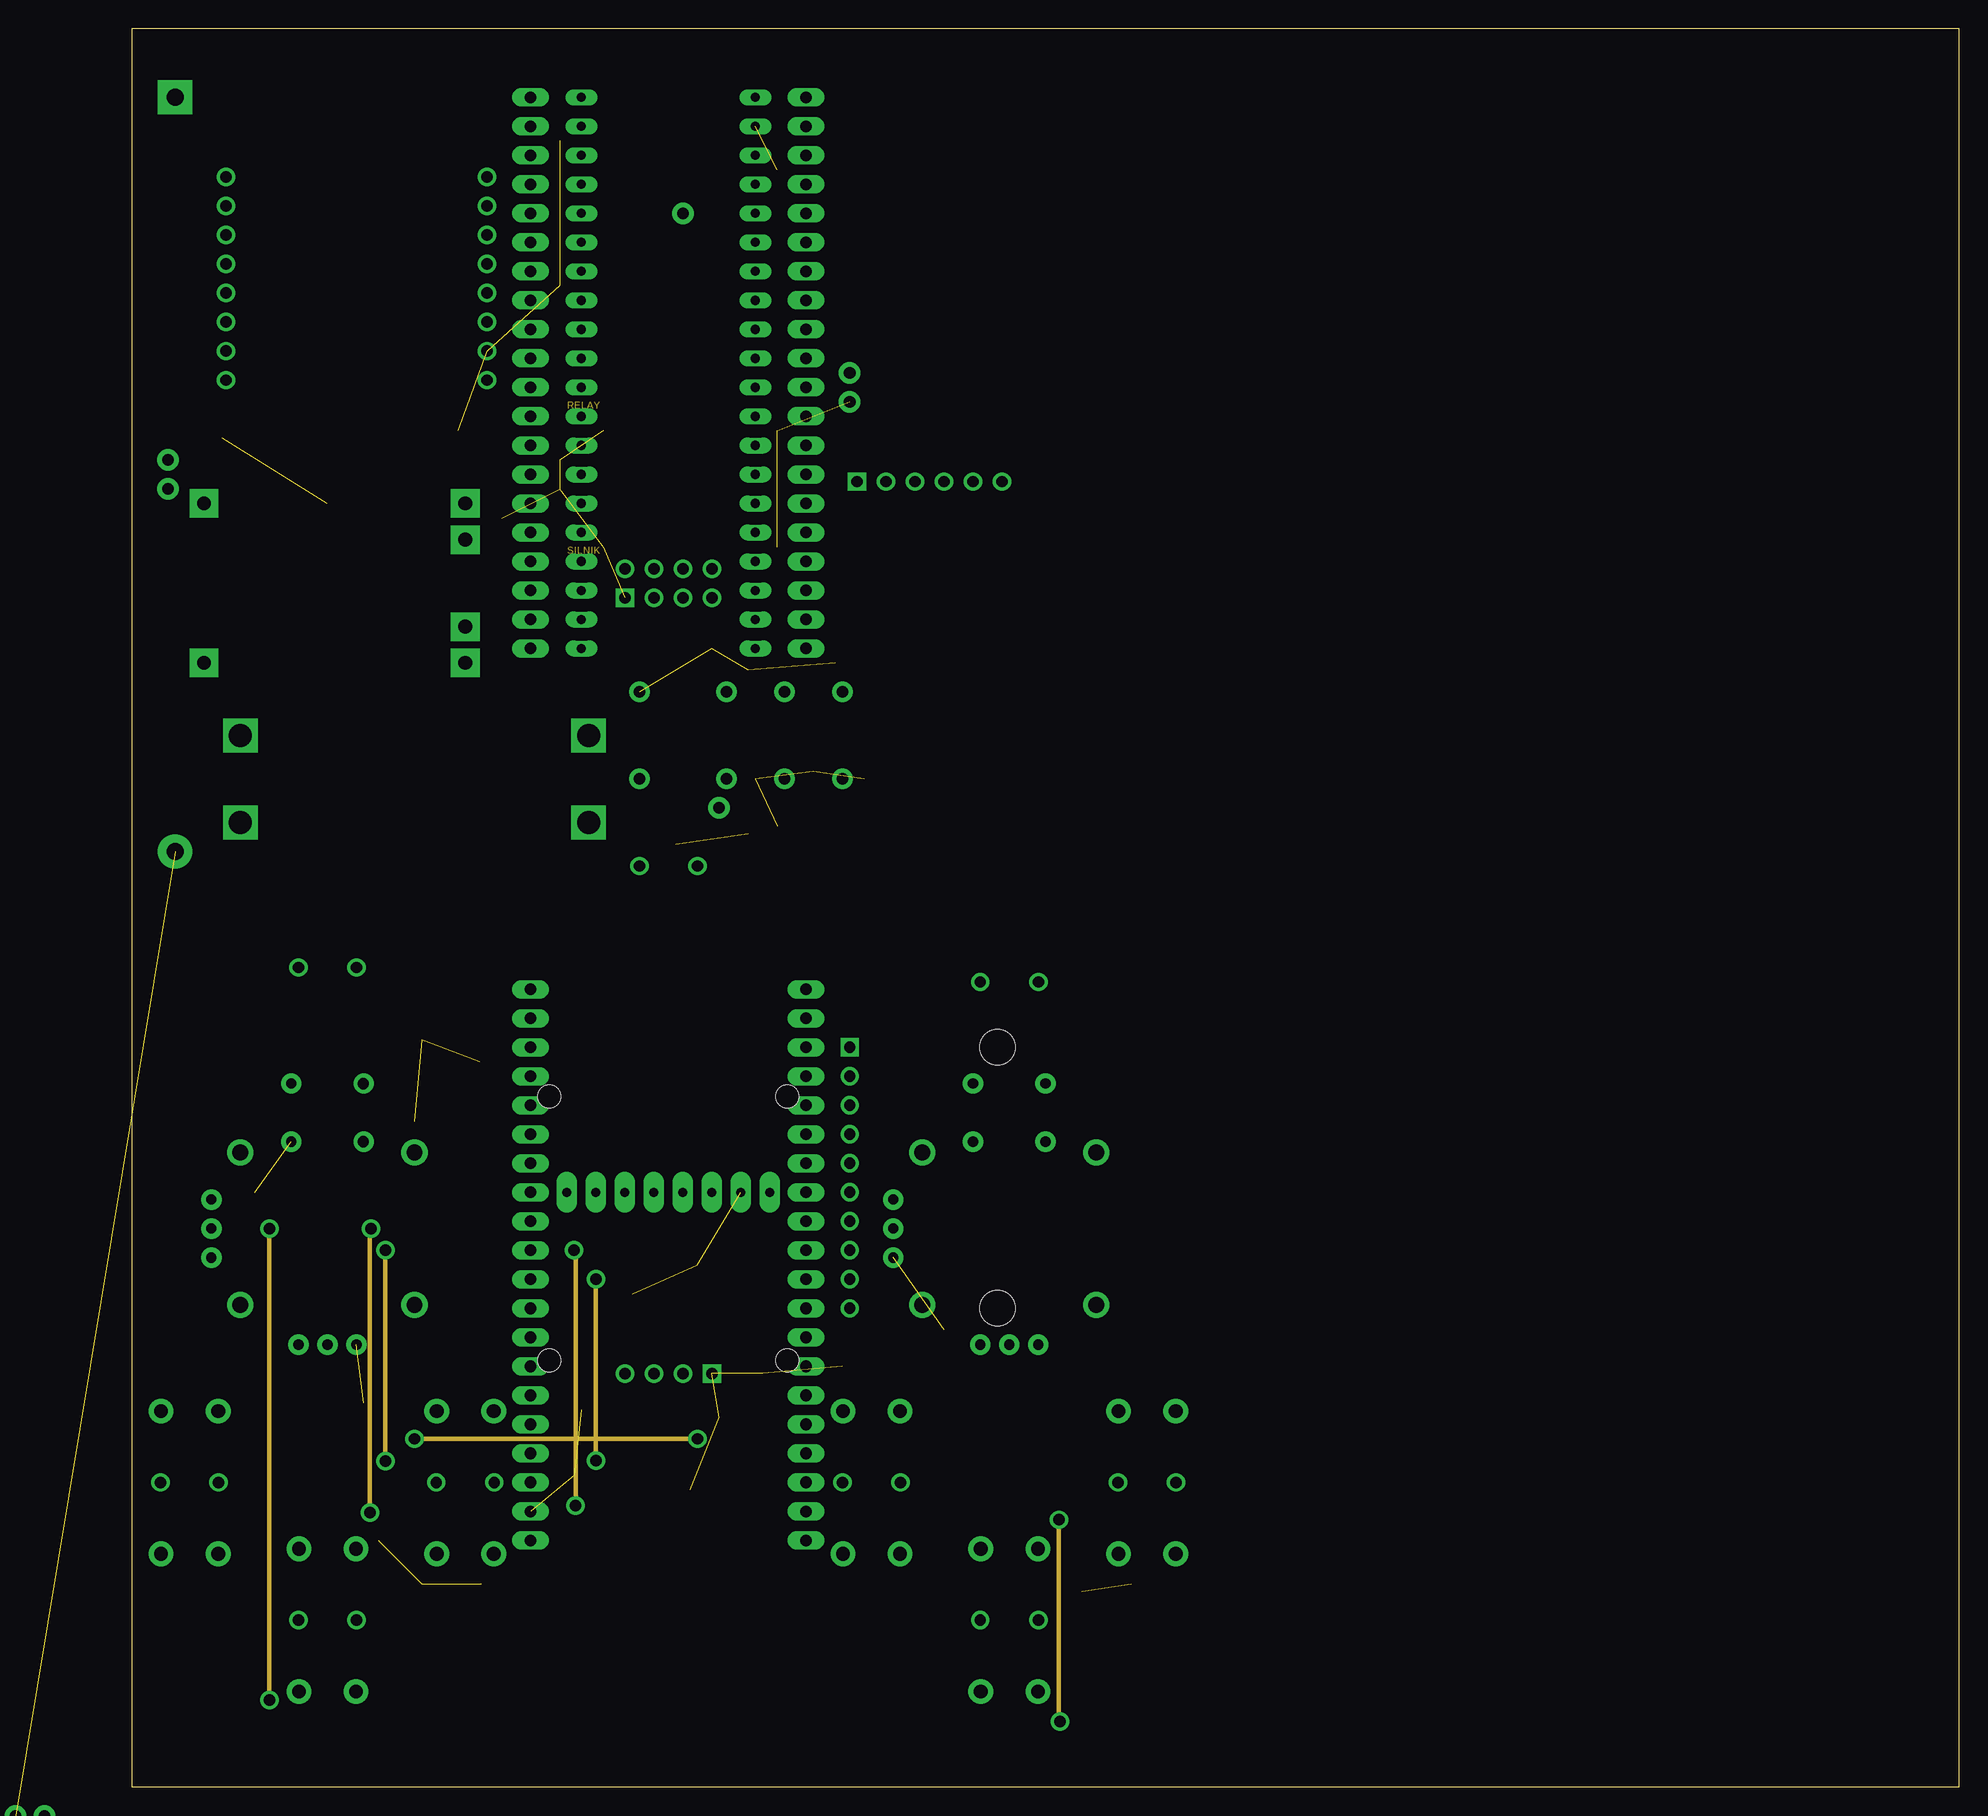
[diagram p4: board, inner layer Route15]
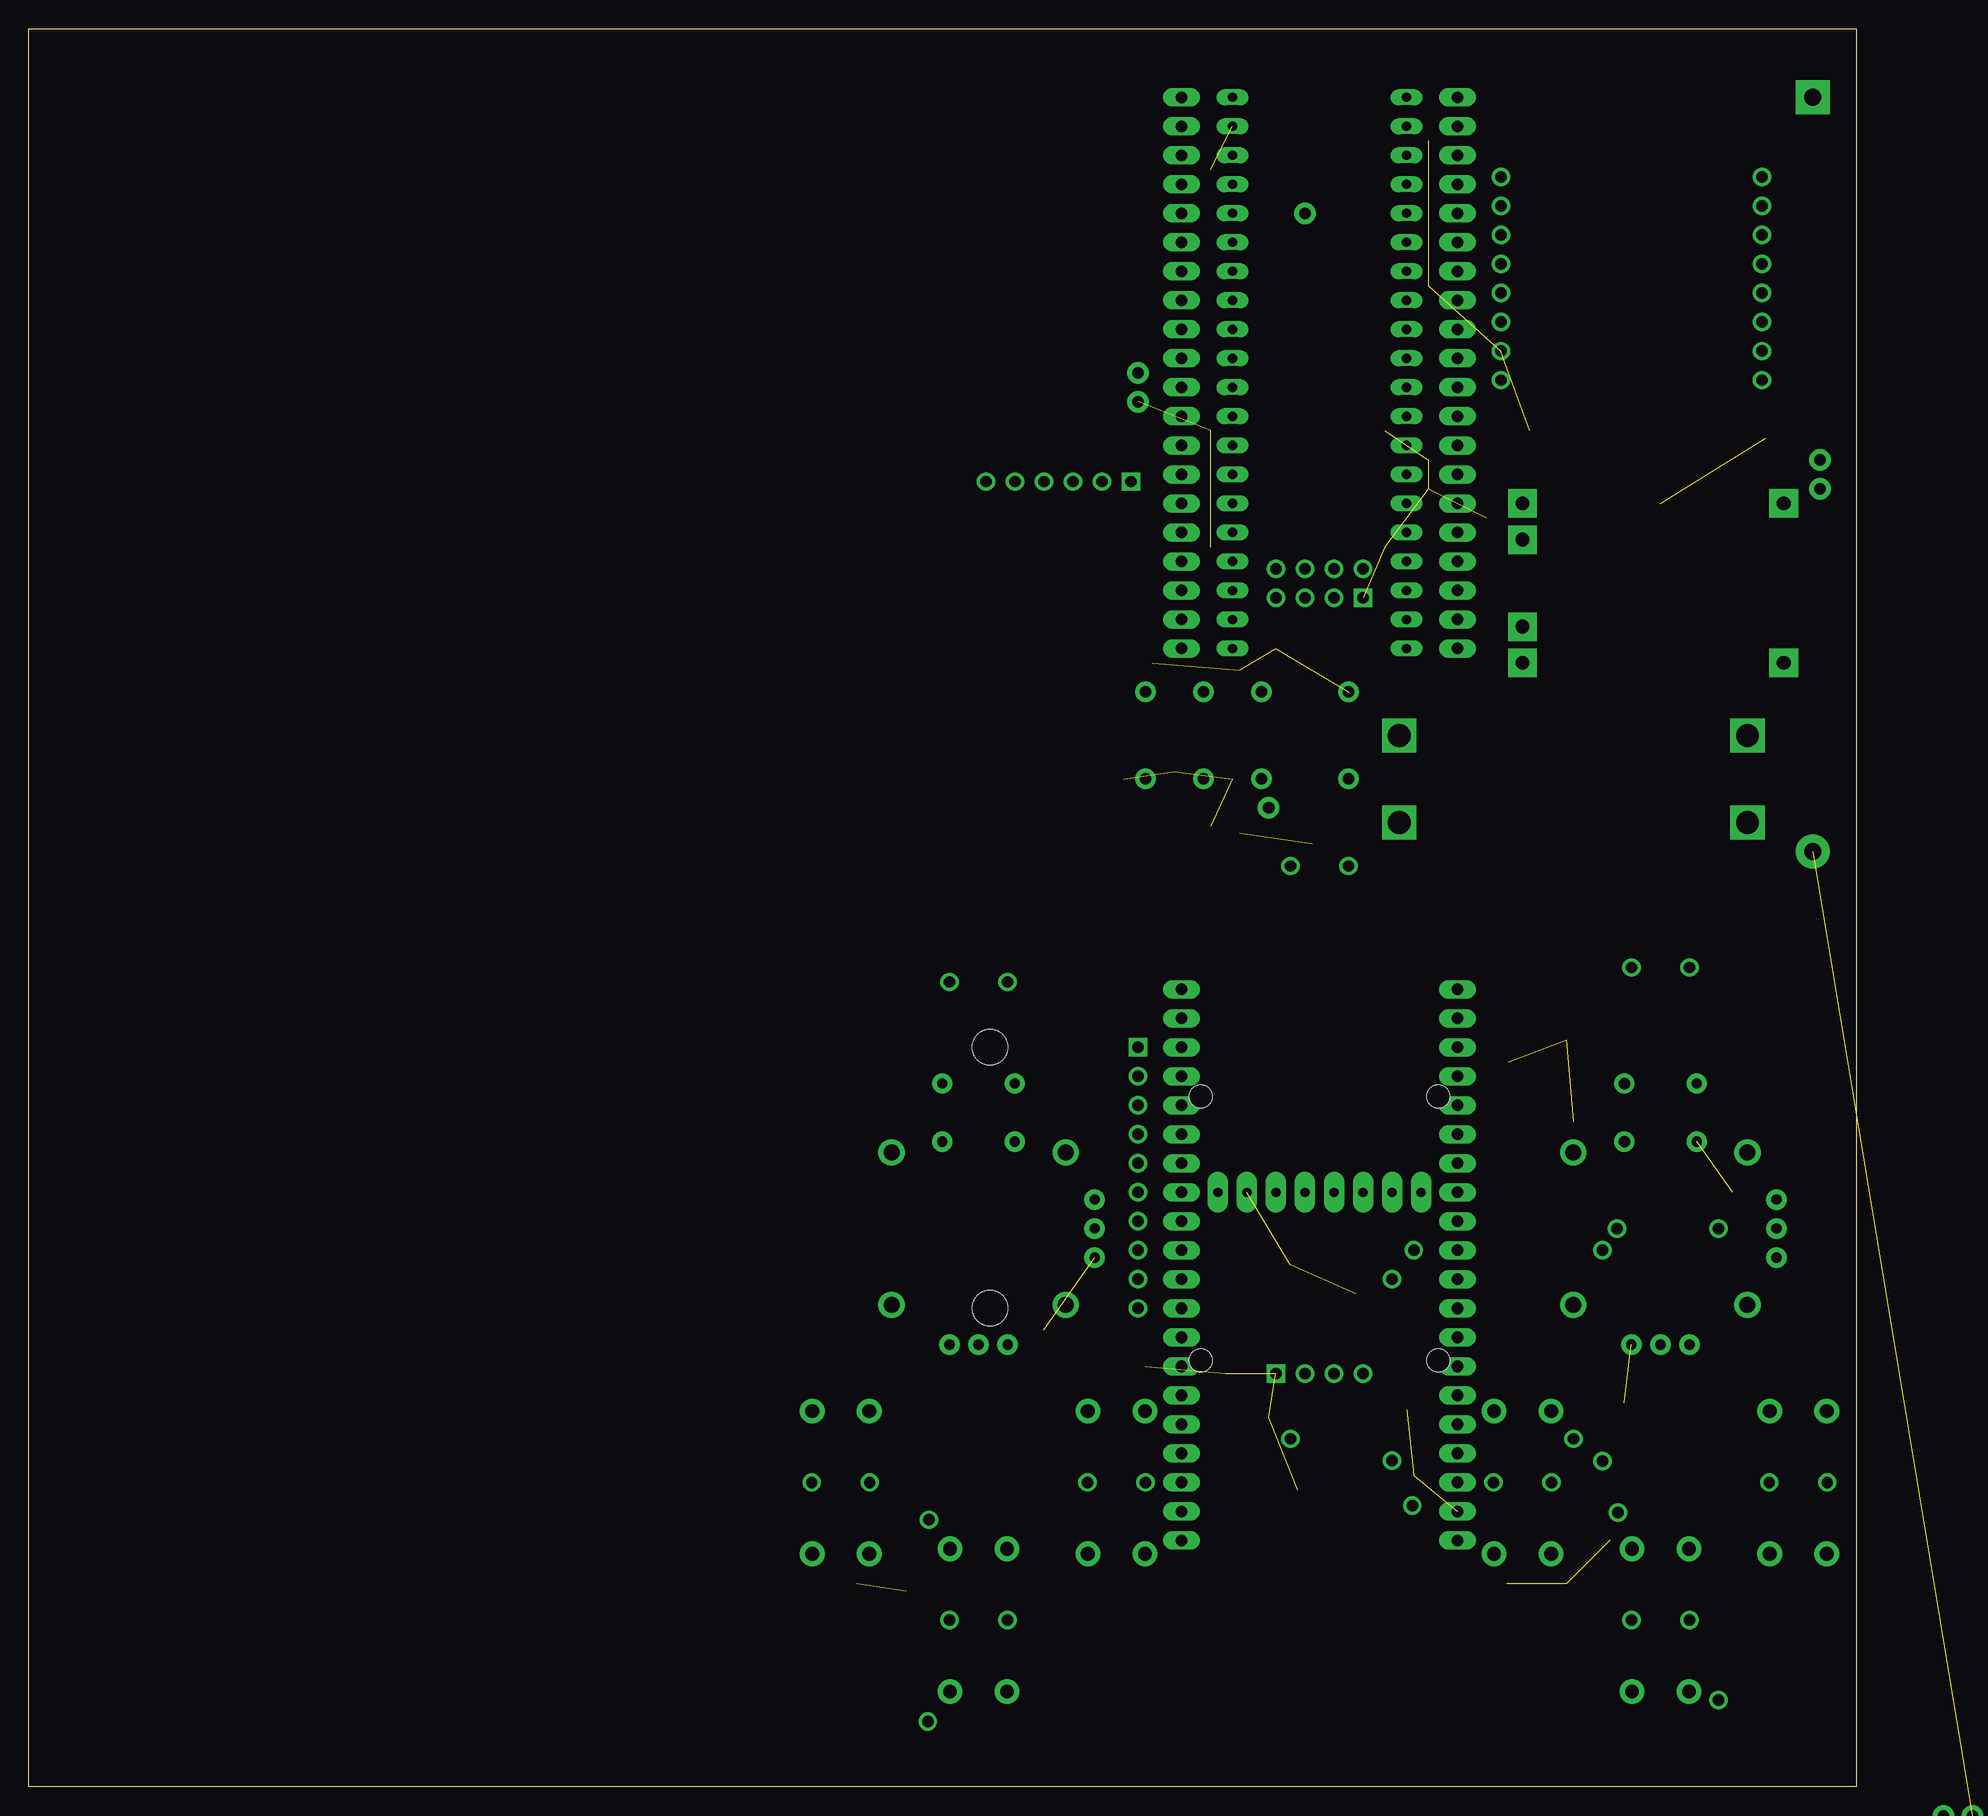
[diagram p5: board, bottom side, seen from below]

Size 160 x 153.97 mm. Coordinates in mm from the lower left corner, seen from the top.
Outline: 0,0 160,0 160,153.97 0,153.97 0,0
Copper layers (1*2*15*16): Top 0.035mm / dielectric 1.5mm / Route2 0.035mm / dielectric 0.15mm / Route15 0.035mm / dielectric 0.2mm / Bottom 0.035mm
Design rules "default *": minimum track width 12mil, minimum drill 0.35mm, track to track 10mil, track to pad 10mil, pad to pad 10mil, via to via 10mil, smd to smd 0mil, copper to edge 0mil, drill to drill 0mil, minimum pad ring 12mil, minimum via ring 12mil, stop-mask expansion 4mil, vias tented up to drill 0mil, thermal gap 0mil

### Footprints (pad centres in the part's own frame; a part is rotated, then mirrored left to right if it is on the bottom)
1X02 = drill 1.016 pad 1.88: 1 0,0; 2 2.54,0
C1206 = smd 1.6 x 1.8: 1 -1.4,0; 2 1.4,0
DO214AC = smd 1.8 x 1.7: A 2.05,0; C -2.05,0
1X01 = drill 1.016 pad 1.88: 1 0,0
1X20 = drill 1.016 long: 1 -24.13,0; 2 -21.59,0; 3 -19.05,0; 4 -16.51,0; 5 -13.97,0; 6 -11.43,0; 7 -8.89,0; 8 -6.35,0; 9 -3.81,0; 10 -1.27,0; 11 1.27,0; 12 3.81,0; 13 6.35,0; 14 8.89,0; 15 11.43,0; 16 13.97,0; 17 16.51,0; 18 19.05,0; 19 21.59,0; 20 24.13,0
G5V-2 = drill 1 pad 1.8: 1 -8.89,-3.81; 4 -1.27,-3.81; 6 3.81,-3.81; 8 8.89,-3.81; 9 8.89,3.81; 11 3.81,3.81; 13 -1.27,3.81; 16 -8.89,3.81
WIRELESS-NRF24L01-PA-EXT = drill 1 square: 1 -18.415,3.81 | drill 1: 2 -15.875,3.81; 3 -18.415,1.27; 4 -15.875,1.27; 5 -18.415,-1.27; 6 -15.875,-1.27; 7 -18.415,-3.81; 8 -15.875,-3.81
R0805 = smd 1.3 x 1.5: 1 -0.95,0; 2 0.95,0
JOYSTICK = drill 0.9 pad 1.778: B1A -3.175,12.7; B1B 3.175,12.7; B2A -3.175,7.62; B2B 3.175,7.62 | drill 0.889 pad 1.778: H1 -2.54,-10.16; H2 0,-10.16; H3 2.54,-10.16; V1 -10.16,2.54; V2 -10.16,0; V3 -10.16,-2.54 | drill 1.397 pad 2.286: MOUNT1 -7.62,6.668; MOUNT2 -7.62,-6.668; MOUNT3 7.62,-6.668; MOUNT4 7.62,6.668
TACTILE_SWITCH_PTH_12MM = drill 1.2 pad 2.159: 1 6.25,-2.5; 2 -6.25,-2.5; 3 6.25,2.5; 4 -6.25,2.5
B1,27 = smd 1.27 x 1.27: TP 0,0
GY-521 = drill 0.8 pad 1.778 long: ADO -8.89,-6.35; GND -8.89,6.35; INT -8.89,-8.89; SCL -8.89,3.81; SDA -8.89,1.27; VCC -8.89,8.89; XCL -8.89,-3.81; XDA -8.89,-1.27
BLUE_PILL = drill 0.8 long: P$1 -7.62,15.24; P$2 -7.62,12.7; P$3 -7.62,10.16; P$4 -7.62,7.62; P$5 -7.62,5.08; P$6 -7.62,2.54; P$7 -7.62,0; P$8 -7.62,-2.54; P$9 -7.62,-5.08; P$10 -7.62,-7.62; P$11 -7.62,-10.16; P$12 -7.62,-12.7; P$13 -7.62,-15.24; P$14 -7.62,-17.78; P$15 -7.62,-20.32; P$16 -7.62,-22.86; P$17 -7.62,-25.4; P$18 -7.62,-27.94; P$19 -7.62,-30.48; P$20 -7.62,-33.02; P$21 7.62,15.24; P$22 7.62,12.7; P$23 7.62,10.16; P$24 7.62,7.62; P$25 7.62,5.08; P$26 7.62,2.54; P$27 7.62,0; P$28 7.62,-2.54; P$29 7.62,-5.08; P$30 7.62,-7.62; P$31 7.62,-10.16; P$32 7.62,-12.7; P$33 7.62,-15.24; P$34 7.62,-17.78; P$35 7.62,-20.32; P$36 7.62,-22.86; P$37 7.62,-25.4; P$38 7.62,-27.94; P$39 7.62,-30.48; P$40 7.62,-33.02
WIRELESS-BLUETOOTH-HC-05 = drill 1 square: 1 -6.35,-17.145 | drill 1: 2 -3.81,-17.145; 3 -1.27,-17.145; 4 1.27,-17.145; 5 3.81,-17.145; 6 6.35,-17.145
DISPLAY-OLED-128X64-I2C = drill 1 square: 1 -3.81,12.7 | drill 1: 2 -1.27,12.7; 3 1.27,12.7; 4 3.81,12.7 | hole 2: -10.414,11.557; 10.414,11.557; 10.414,-11.557; -10.414,-11.557
MOUSE_BT = drill 1: P$1 -2.54,0; P$2 2.54,0
BATTERY-LI-MH12210 = drill 1.5 pad 3 square: BAT+ -33.02,0 | drill 1.5 pad 3: BAT- 33.02,0
WEMOS-D1-MINI-SHIELD = drill 1: JP1.1 -11.43,12.065; JP1.2 -11.43,9.525; JP1.3 -11.43,6.985; JP1.4 -11.43,4.445; JP1.5 -11.43,1.905; JP1.6 -11.43,-0.635; JP1.7 -11.43,-3.175; JP1.8 -11.43,-5.715; JP2.1 11.43,12.065; JP2.2 11.43,9.525; JP2.3 11.43,6.985; JP2.4 11.43,4.445; JP2.5 11.43,1.905; JP2.6 11.43,-0.635; JP2.7 11.43,-3.175; JP2.8 11.43,-5.715
DC-DC-STEP-UP-MT3608 = drill 2 pad 2.8 square: IN+ 15.24,3.81; IN- 15.24,-3.81; OUT+ -15.24,3.81; OUT- -15.24,-3.81
ADC-4CH-ADS1115 = drill 1 square: 1 -6.35,11.43 | drill 1: 2 -6.35,8.89; 3 -6.35,6.35; 4 -6.35,3.81; 5 -6.35,1.27; 6 -6.35,-1.27; 7 -6.35,-3.81; 8 -6.35,-6.35; 9 -6.35,-8.89; 10 -6.35,-11.43 | hole 3.1: 6.604,11.43; 6.604,-11.43
BATTERY-CHARGER-LI-PROT = drill 1.2 pad 2.5 square: B+ 10.795,3.81; B- 10.795,-3.81; IN+ -12.065,6.985; IN- -12.065,-6.985; OUT+ 10.795,6.985; OUT- 10.795,-6.985

### Placement (x,y rotation side)
BAT  3.17,116.2 270 top
BUZZER  62.87,121.28 90 top
C1  46.99,85.09 0 top
C2  76.83,23.5 0 top
C3  64.77,17.78 180 top
C4  29.21,17.78 180 top
C5  17.14,23.5 0 top
C6  17.14,69.22 0 top
C7  5.08,17.78 180 top
C8  88.9,17.78 0 top
C9  76.83,67.95 180 top
C10  69.22,59.69 270 top
C11  24.77,59.69 270 top
D1  59.69,84.45 270 top
D2  63.5,83.82 270 top
D3  67.31,84.45 270 top
D4  12.06,115.57 180 top
D5  24.77,115.57 0 top
D6  64.77,92.71 270 top
J1  6.35,112.4 0 top
J2  51.44,85.72 0 top
J3  48.26,137.79 0 top
J4  34.92,123.82 90 top
J5  59.05,123.82 90 top
J6  34.92,45.72 90 top
J7  59.05,45.72 90 top
K6  53.34,92.08 0 top
M1  46.99,122.56 90 top
MOTOR  -10.16,-2.54 0 top  (outside the outline)
R1  76.83,26.04 0 top
R2  6.99,115.57 180 top
R3  56.52,85.09 90 top
R4  6.99,118.11 180 top
R5  51.44,81.92 90 top
R6  55.24,59.69 180 top
R7  55.24,57.15 180 top
R8  45.72,33.02 270 top
R9  43.18,33.02 270 top
R10  53.98,82.55 90 top
R11  76.83,64.14 0 top
R12  88.9,12.7 0 top
R13  30.48,115.57 180 top
R14  62.87,127.63 90 top
R15  5.08,12.7 0 top
R16  17.14,64.14 180 top
R17  17.14,28.58 180 top
R18  29.21,12.7 0 top
R19  64.77,12.7 0 top
R20  76.83,28.58 180 top
R21  66.67,57.79 270 top
R22  27.3,57.79 270 top
R23  64.77,15.24 180 top
R24  88.9,15.24 0 top
R25  66.67,61.59 270 top
R26  72.39,66.04 180 top
R27  5.08,15.24 180 top
R28  17.14,66.67 0 top
R29  17.14,26.04 0 top
R30  29.21,15.24 180 top
R31  27.3,61.59 270 top
S1  17.14,48.9 0 top
S2  76.83,48.9 0 top
S3  76.83,14.61 90 top
S4  64.77,26.67 270 top
S5  88.9,26.67 270 top
S7  5.08,26.67 270 top
S9  17.14,14.61 90 top
S10  29.21,26.67 270 top
TP1  17.14,112.4 0 top
TP2  28.57,118.75 0 top
TP3  50.8,99.69 0 top
TP4  54.61,88.27 0 top
TP5  61.59,98.43 0 top
TP6  41.27,118.75 0 top
TP7  32.38,111.12 0 top
TP8  56.52,108.59 0 top
TP9  37.47,139.06 0 top
TP10  41.27,108.59 0 top
TP11  56.52,141.6 0 top
TP12  37.47,116.2 0 top
TP13  37.47,144.15 0 top
TP14  37.47,141.6 0 top
TP15  37.47,131.44 0 top
TP16  37.47,113.66 0 top
TP17  39.37,33.02 0 top
TP18  56.52,111.12 0 top
TP19  30.48,63.5 0 top
TP20  56.52,118.75 0 top
TP21  64.14,88.27 0 top
TP22  53.98,97.79 0 top
TP23  59.69,88.9 0 top
TP24  47.62,82.55 0 top
TP25  25.4,17.78 0 top
TP26  38.73,27.3 0 top
TP27  43.81,43.18 0 top
TP28  21.59,21.59 0 top
TP29  62.23,36.83 0 top
TP30  49.53,45.72 0 top
TP31  20.32,33.66 0 top
TP32  71.12,40.01 0 top
TP33  48.9,26.04 0 top
TP34  10.79,52.07 0 top
TP35  83.19,17.15 0 top
TP36  51.44,32.39 0 top
TP37  25.4,65.41 0 top
TP38  55.24,36.2 0 top
U1  46.99,43.18 270 top
U$1  46.99,132.72 0 top
U$2  69.85,131.44 0 top
U$3  46.99,48.9 180 top
U$4  64.77,26.67 0 top
U$5  3.81,114.94 270 top
U$6  19.68,128.91 0 top
U$7  24.77,88.27 180 top
U$8  46.99,80.65 180 top
U$9  76.83,70.48 0 top
U$10  76.83,14.61 180 top
U$11  88.9,26.67 0 top
U$12  17.14,71.75 180 top
U$13  5.08,26.67 0 top
U$14  17.14,14.61 180 top
U$16  29.21,26.67 0 top
U$17  69.22,53.34 0 top
U$18  18.41,105.41 0 top

### Tracks (layer width: path | path; a pad name or v marks a point on that pad's centre or on a via)
3V3_
  Top 0.406: J5.18 U$1.P$23 | M1.2 43.18,106.4 41.24,104.45 41.24,101.56 U$1.P$20 J4.1
  Route2 0.305: M1.2 53.55,117.05 53.55,140.77 54.61,141.83 U$1.P$23
3V3_S
  Top 0.406: 67.61,54.9 68.55,53.96 73.01,53.96 75.89,56.84 R11.1 75.25,64.77 U$17.1 J7.18 57.78,64.77 54.3,61.28 R6.2 R7.2 | R21.2 67.61,55.9 67.61,54.9 | 67.61,54.9 66.67,53.96 S2.V1 66.67,50.8 70.81,46.66 70.81,42.22 S2.H1 74.93,38.73 76.28,40.08 77.88,40.08 78.54,40.74 80.21,40.74 81.38,39.57 81.38,37.9 77.78,34.31 R20.1 84.86,21.5 84.86,15.79 R12.1 | R9.2 R8.2 46.51,32.86 46.66,32.86 48.73,34.93 | 51.79,34.93 48.73,34.93 | U1.VCC 55.88,39.02 51.79,34.93 | U$3.2 48.73,35.73 48.73,34.93 | 87.95,13.19 R12.1 | R12.1 67.77,12.7 66.56,11.49 64.88,11.49 64.61,11.76 64.61,11.91 R19.1 56.31,20.21 56.31,29.08 57.72,30.48 62,30.48 63.81,32.28 63.81,33.56 61.8,35.56 57.72,35.56 57.09,34.93 51.79,34.93 | R17.1 23.5,23.18 23.5,17.47 | 23.5,17.47 R18.1 29.05,11.91 29.05,11.76 29.32,11.49 31,11.49 34.92,15.42 J6.1 36.2,22.86 36.26,22.86 37.01,23.6 37.01,27.2 36.26,27.94 33.02,27.94 28.25,32.71 28.25,33.56 26.89,34.92 19.06,34.92 15.24,38.73 S1.H1 14.61,43.81 S1.V1 9.51,53.96 13.32,53.96 15.87,56.52 18.97,56.52 | R15.1 4.92,11.91 4.92,11.76 5.19,11.49 18.36,11.49 20.95,14.08 20.95,14.92 23.5,17.47 | R16.1 18.97,63.26 18.97,56.52 | R22.2 26.36,55.9 26.36,54.9 25.43,53.96 20.97,53.96 18.97,55.96 18.97,56.52
  Route2 0.305: J7.18 53.76,59.48 52.9,59.48 52.28,58.86 52.28,58 38.34,44.05 38.34,25.82 34.92,22.41 J6.1
5V
  Top 0.305: K6.13 51.95,95.88 | 14.61,115.57 D4.C
  Top 0.406: U$2.5 62.87,103.5 57.72,103.5 56.97,102.76 56.97,102.25 55.78,101.06 | 55.78,101.06 55.58,100.86 53.42,100.86 52.74,100.18 52.74,96.56 K6.13 44.44,103.51 44.44,107.2 43.7,107.94 42.66,107.94 | 42.66,107.94 39.49,104.78 U$1.P$18 J4.3 | D3.C 67.31,88.94 67.4,89.02 67.4,94.53 60.96,100.97 55.88,100.97 55.78,101.06 | 42.66,107.94 42.66,121.62 40.45,123.82 33.59,123.82 32.95,123.19 U$6.JP2.8 23.5,115.57 D5.C 14.61,115.57
ASD
  Top 0.406: R14.1 BUZZER.2
BAT
  Top 0.406: U$1.P$32 56.97,122.38 56.97,123.08 57.72,123.82 60.39,123.82 61.47,122.75 61.47,120.71 62.29,119.89 63.44,119.89 64.92,121.37 64.92,142.16 60.39,146.69 33.59,146.69 6.83,119.93 6.83,118.9 R4.2 6.04,117.62 7.14,116.51 7.14,116.36 R2.1 D4.A
BAT+
  Top 0.406: C1.1 45.59,81.78 U$8.P$2 13.34,80.65 U$7.IN+ 9.53,88.43 11.48,90.39 11.48,107.46 8.26,110.69 | BAT.1 4.64,114.74 4.64,110.96 4.91,110.69 8.26,110.69 | 8.26,110.69 27.5,110.69 U$18.OUT+ | R2.2 3.81,115.57 BAT.1 | BAT.1 3.17,147.32 U$5.BAT+
BT_LA
  Top 0.406: J5.13 57.78,131.44 53.53,131.44 52.74,132.23 52.74,133.31 J3.1
BT_LA_S
  Top 0.406: 58.34,52.07 J7.13 58.67,52.07 56.44,54.3 54.16,54.3 52.53,55.94 52.53,63.39 57.72,68.58 60.39,68.58 62.93,66.04 R26.2 71.44,67 71.75,67.31 74.8,67.31 C9.2
BT_LB
  Top 0.305: U$1.P$11 J4.10
BT_LB_S  (via drill 1)
  Top 0.406: R24.2 90.3,15.69 C8.2 90.3,14.94 90.96,14.28 90.96,11.76 90.03,10.83 58.38,10.83 v40.64,28.58 | v40.64,44.45 J6.10
  Route15 0.406: v40.64,28.58 v40.64,44.45
BT_LC
  Top 0.305: J4.11 U$1.P$10
BT_LC_S  (via drill 1)
  Top 0.406: R1.2 78.23,25.59 C2.2 81.08,23.5 v81.18,23.4 | v81.28,5.72 62.57,5.72 43.65,24.63 v38.87,24.63 | v38.73,46.99 J6.11
  Route15 0.406: v81.18,23.4 81.18,5.82 v81.28,5.72 | v38.87,24.63 38.87,46.86 v38.73,46.99
BT_LD
  Top 0.305: U$1.P$5 J4.16
BT_LD_S  (via drill 1)
  Top 0.406: 28.26,14.75 R30.2 27.81,15.69 C4.2 26.71,18.88 26.07,18.88 24.16,20.8 24.16,23.45 22.23,25.38 v22.23,28.52 | v22.23,46.99 22.23,47.84 29.83,55.45 29.83,56.38 33.14,59.69 J6.16
  Route15 0.406: v22.23,28.52 v22.23,46.99
BT_POWER
  Top 0.305: 51.59,82.71 R5.2 | D3.A 67.24,82.48
  Top 0.406: U$1.P$16 39.37,109.66 37.5,107.8 37.5,107.28 36.26,106.05 33.59,106.05 30.85,103.31 27.77,103.31 27.5,103.04 27.5,96.99 29.14,95.35 42.24,95.35 43.07,94.53 52.63,94.53 56.01,97.9 57.99,97.9 63.21,92.68 66.08,92.68 66.74,92.02 66.74,89.3 66,88.56 66,83.71 D3.A | 51.59,82.71 52.23,82.07 52.37,82.07 52.85,81.6 R10.1 58.1,81.6 58.65,81.05 60.73,81.05 62.19,82.51 62.19,82.86 62.46,83.13 64.54,83.13 65.19,82.48 67.24,82.48
BT_R_S
  Top 0.406: J7.14 60.33,53.34 60.39,53.34 61.14,52.6 61.14,51.54 60.39,50.8 57.72,50.8 56.97,50.06 56.97,41.38 57.72,40.64 59.69,40.64 60.39,40.64 64.47,36.57 64.47,32.01 60.4,27.94 57.72,27.94 56.97,27.2 56.97,21.06 59.15,18.88 62.27,18.88 C3.2 63.82,17.33 R23.2
BT_RA
  Top 0.305: J4.19 U$1.P$2
BT_RA_S
  Top 0.406: R28.2 18.55,67.12 C6.2 32.95,69.22 33.59,68.58 33.66,68.58 J6.19
BT_RB
  Top 0.305: J4.18 U$1.P$3
BT_RB_S  (via drill 1)
  Top 0.406: R27.2 4.13,17.33 C7.2 3.68,14.3 3.02,13.64 3.02,11.76 3.95,10.83 8.85,10.83 v12.06,7.62 | v12.06,48.9 16.47,53.3 25.82,53.3 28.51,56 28.51,58.43 34.86,64.77 J6.18
  Route15 0.406: v12.06,7.62 v12.06,48.9
BT_RC
  Top 0.305: J4.17 U$1.P$4
BT_RC_S  (via drill 1)
  Top 0.406: R29.2 18.09,23.95 C5.2 20.32,23.5 v20.86,24.03 | J6.17 34.75,62.23 29.17,56.66 29.17,55.72 26.09,52.64 24.7,52.64 v20.95,48.9
  Route15 0.406: v20.86,24.03 20.86,48.8 v20.95,48.9
BT_RD
  Top 0.406: U$1.P$27 J5.14
BT_RS
  Top 0.305: J4.20 U$1.P$1
BT_RS_S
  Top 0.406: C11.1 26.22,62.55 R31.1 30.8,66.04 36.26,66.04 37.01,66.78 37.01,67.84 36.26,68.58 36.2,68.58 J6.20
BT_RX
  Top 0.406: U$2.3 67.83,114.3 65.9,116.22 62.23,116.22 62.22,116.2 55.88,116.2 U$1.P$33
BT_TX
  Top 0.406: U$1.P$34 56.45,114.94 57.72,113.66 60.61,113.66 62.51,115.56 64.78,115.56 U$2.2
BUTTON
  Top 0.406: C1.2 49.53,83.95 U$8.P$1 49.85,80.97 R5.1 52.55,80.97 53.12,80.39 62.12,80.39 D2.A
BUZZ
  Top 0.406: U$1.P$28 56.45,130.18 57.72,128.91 62.55,128.91 R14.2
CE
  Top 0.406: M1.3 46.34,103.52 46.34,103.34 47.46,102.22 51.6,102.22 52.99,103.61 55.8,103.61 56.48,104.29 56.48,105.26 54.61,107.12 U$1.P$37
CONVERTER
  Top 0.406: D6.C 63.35,94.76 K6.9
CSN
  Top 0.406: M1.4 47,105.4 47,103.62 47.74,102.88 51.32,102.88 53.22,104.78 U$1.P$38
ENABLE
  Top 0.305: 59.62,86.43 D1.C
  Top 0.406: J2.1 56.2,85.72 R3.2 59.23,86.04 59.62,86.43 | D1.C 62.87,86.5 D2.C
GND  (23 unrouted)
  Top 0.305: 60.65,147.29 59.72,147.29 J5.20
  Top 0.406: BUZZER.1 62.87,121.85 64.26,123.25 64.26,140.28 60.39,144.15 60.33,144.15 J5.19 U$1.P$22 48.39,139.19 47.68,139.19 46.86,138.37 46.86,137.86 40.34,131.34 38.18,131.34 37.01,130.16 37.01,127.11 36.26,126.37 33.59,126.37 32.95,125.73 U$6.JP2.7 23.5,118.11 R4.1 | U$1.P$21 J5.20 59.66,147.34 60.67,147.34 71.12,136.89 U$2.4 | U$7.OUT- 40.01,88.1 38.05,86.14 38.05,82.77 38.32,82.5 41.69,82.5 41.96,82.77 41.96,83.81 44.6,86.45 49.38,86.45 49.65,86.18 49.65,85.54 51.21,83.97 52.37,83.97 52.85,83.5 R10.2 55.88,83.5 R3.1 | BAT.2 3.17,82.55 U$5.BAT- 7.57,85.67 7.57,87.41 9.53,89.36 U$7.IN- 6.35,95.25 U$18.IN- | U$1.P$19 J4.2 33.66,100.97 33.59,100.97 32.84,100.22 32.84,99.17 33.3,98.71 | M1.1 41.9,102.86 41.9,99.87 40.45,98.43 33.59,98.43 33.3,98.71 | U$18.OUT- 29.49,98.71 33.3,98.71
  Route2 0.305: U$7.IN- U$7.OUT- | U$1.P$19 42.61,105.47 46.22,105.47 46.93,106.18 46.93,109.56 53.78,116.42 55.05,116.42 55.67,117.04 55.67,143.31 54.61,144.37 U$1.P$22 U$1.P$21 | U$18.IN- U$18.OUT-
  pour Top (isolate 0.406, no thermals): 1.91,150.5 92.08,150.5 92.08,80.01 1.91,80.01
GND_S  (via drill 1)  (16 unrouted)
  Top 0.406: U$4.P$2 67.31,20.46 S4.3 67.27,18.88 C3.1 71.12,17.78 U$10.P$2 74.3,20.82 S3.3 74.33,22.4 75.18,23.24 | 75.18,23.24 C2.1 | U$17.2 62.87,61.77 63.03,61.61 63.7,61.61 63.91,61.82 | J7.19 57.78,66.04 57.72,66.04 53.19,61.51 53.19,56.21 53.52,55.88 63.38,55.88 63.44,55.94 | C10.2 70.99,56.52 S2.B2A 73.66,59.69 75.01,61.04 75.01,62.15 73.51,63.65 65.74,63.65 63.91,61.82 | U$3.1 53.34,38.73 U1.GND 53.34,54.19 51.87,55.66 | 51.87,55.66 51.87,63.66 57.44,69.24 58.45,69.24 J7.20 59.69,70.48 72.51,70.48 73.77,71.75 74.82,71.75 76.08,70.48 U$9.P$2 78.23,69.34 C9.1 78.23,65.73 78.89,65.07 78.89,63.2 78.66,62.97 78.66,43.22 87.94,33.95 87.94,30.17 U$11.P$2 91.44,20.46 S5.3 90.14,20.42 C8.1 | 63.91,61.82 63.91,61.37 64.79,60.49 64.79,57.29 63.44,55.94 | 61.6,43.93 62.34,43.19 63.39,43.19 66.56,46.36 S2.V3 67.61,45.41 67.61,41.56 71.79,37.39 77.39,37.39 78.74,38.73 S2.H3 | 61.6,43.93 61.6,50.05 62.36,50.81 63.39,50.81 64.13,51.55 64.13,52.7 64.14,52.7 64.14,55.25 63.44,55.94 | 61.6,43.93 61.6,41.39 62.35,40.64 66.67,40.64 74.78,32.53 74.78,25.1 75.18,24.69 75.18,23.24 | 31.75,24.13 U$16.P$2 28.45,26.67 27.19,27.93 25.41,27.93 23.56,29.78 15.36,29.78 15.09,29.51 15.09,25.1 15.49,24.69 15.49,23.24 | 31.75,24.13 31.75,20.46 S10.3 31.71,18.88 C4.1 | J6.2 31.75,24.13 | 15.49,23.24 14.64,22.4 S9.3 14.61,20.82 U$14.P$2 13.39,14.61 S7.3 | 15.49,23.24 C5.1 | S7.3 7.62,20.46 U$13.P$2 6.04,28.25 6.04,33.56 6.99,34.5 S1.V3 6.99,46.99 5.64,48.34 5.64,53.94 8.86,57.16 10.19,57.16 10.84,56.52 S1.B2A 13.97,59.69 12.62,61.04 12.62,66.09 C6.1 15.74,70.62 U$12.P$2
  Top 0.406: S7.3 7.58,18.88 C7.1 | v20.28,56.52 22.05,58.29 C11.2 | S1.H3 23.16,42.22 23.16,45.46 33.59,55.88 36.26,55.88 37.18,54.97 51.17,54.97 51.87,55.66
  Route2 0.305: J7.19 51.22,59.48 50.36,59.48 49.74,58.86 49.74,58 37.73,45.98 37.73,26.93 J6.2
  Route2 0.406: J7.20 J7.19 | S1.B2A v20.28,56.52
  pour Top (isolate 0.406, no thermals): 1.91,72.39 92.08,72.39 92.08,1.91 1.91,1.91
HORISONTAL
  Top 0.305: 58.42,109.86 J5.5
  Top 0.406: U$1.P$36 58.42,109.86
HORISONTAL2_S
  Top 0.406: S2.H2 77.47,38.73 78.82,40.08 79.93,40.08 80.72,39.29 80.72,38.18 79.27,36.73 71.52,36.73 66.34,41.91 U$17.10
  Bottom 0.305: S2.H2 76.78,38.68
HORISONTAL_S
  Top 0.406: J7.5 57.15,31.75 54.62,29.22 49.01,29.22 47.74,30.48 31.98,30.48 31.86,30.59 28.91,33.55 28.91,33.83 27.16,35.58 20.3,35.58 S1.H2
MISO
  Top 0.406: U$1.P$30 54.61,124.9 52.74,123.04 52.74,106.08 M1.7
MOSI
  Top 0.305: 53.84,126.87 U$1.P$29
  Top 0.406: M1.6 48.88,107.3 48.88,107.48 51.42,110.02 51.42,125.19 53.15,126.92 53.89,126.92 U$1.P$29
N$1
  Top 0.406: U$7.OUT+ 40.01,85.74 44.52,90.26 64.37,90.26 D6.A
N$2
  Top 0.406: U$10.P$1 79.38,20.82 S3.1 78.05,22.14 77.25,22.14 76.69,22.69 76.69,24.58 75.89,25.39 R1.1 R20.2
N$3
  Top 0.406: U$4.P$1 62.23,20.46 S4.1 63.55,19.14 64.36,19.14 64.91,18.58 64.91,16.69 65.72,15.88 R23.1 R19.2
N$5
  Top 0.406: R25.2 R21.1 67.77,59.83 70.3,59.83 72.07,61.59 S2.B1A
N$6
  Top 0.406: U$11.P$1 86.36,20.46 S5.1 86.4,19.03 86.24,18.87 86.24,16.69 86.51,16.42 86.77,16.42 R24.1 88.27,14.93 88.27,14.43 89.06,13.64 89.06,13.49 R12.2
N$7
  Top 0.406: R26.1 76.2,66.04 76.61,66.45 | U$9.P$1 75.48,69.3 76.42,69.3 76.83,68.89 76.83,66.67 76.61,66.45 | R11.2 77.57,64.35 77.57,65.5 76.61,66.45
N$8
  Top 0.305: 26.67,20.46 S10.1
  Top 0.406: U$16.P$1 26.67,20.46 | S10.1 27.99,19.14 28.8,19.14 29.35,18.58 29.35,16.69 30.16,15.88 R30.1 R18.2
N$9
  Top 0.406: U$14.P$1 19.68,20.82 S9.1 18.36,22.14 17.56,22.14 17,22.69 17,24.58 16.2,25.39 R29.1 R17.2
N$10
  Top 0.406: U$12.P$1 18.5,70.57 17.56,70.57 17.29,70.3 17.29,67.91 16.99,67.61 16.99,67.47 R28.1 R16.2
N$11
  Top 0.406: U$13.P$1 2.54,20.46 S7.1 3.86,19.14 4.67,19.14 5.22,18.58 5.22,16.69 6.03,15.88 R27.1 R15.2
N$12  (via drill 1)
  Top 0.406: v20.28,61.59 21.59,61.59 23.5,59.69 26.35,59.69 R31.2 R22.1
  Route2 0.406: S1.B1A v20.28,61.59
ON
  Top 0.406: D1.A 61.8,84.51 64.54,84.51 64.63,84.6 64.81,84.78 65.34,85.32 65.34,88.84 66.08,89.57 66.08,91.75 65.81,92.02 62.94,92.02 57.71,97.24 56.28,97.24 52.91,93.87 42.79,93.87 41.97,94.69 28.86,94.69 26.84,96.71 26.84,103.31 27.5,103.97 29.45,103.97 32.84,107.36 32.84,107.84 33.59,108.59 36.26,108.59 37.5,109.82 37.5,110.34 38.18,111.02 40.34,111.02 41.24,111.91 41.24,115.42 39.37,117.28 U$1.P$13
RX
  Top 0.406: U$1.P$7 38.1,133.99 33.59,133.99 32.84,134.73 32.84,135.95 31.62,137.17 30.59,137.17 29.85,137.91 29.85,138.95 31.11,140.22 U$6.JP2.1
SCK
  Top 0.305: 49.54,107.2 52.13,109.8
  Top 0.406: U$1.P$31 54.61,122.75 56.48,124.61 56.48,125.58 55.8,126.26 53.42,126.26 52.08,124.92 52.08,109.75 49.54,107.2 49.54,105.42 M1.5
SCL
  Top 0.305: U$1.P$15 J4.6
SCL_IMU
  Top 0.406: J5.15 U$1.P$26
SCL_IMU_S
  Top 0.406: U$17.3 61.66,59.69 60.39,58.42 60.33,58.42 J7.15 R7.1
SCL_S
  Top 0.406: R8.1 U$3.3 50.8,41.28 U1.SCL 49.61,53.26 49.61,53.52 48.82,54.3 37.54,54.3 36.58,53.34 33.59,53.34 32.84,52.6 32.84,36.3 33.59,35.56 33.66,35.56 J6.6
SDA
  Top 0.305: J4.7 U$1.P$14
SDA_IMU
  Top 0.406: J5.16 U$1.P$25
SDA_IMU_S
  Top 0.406: R6.1 56.46,59.69 56.91,59.25 57.9,59.25 58.34,59.69 J7.16 60.45,59.69 61.71,60.95 63.39,60.95 64.13,60.21 64.13,59.17 62.87,57.91 U$17.4
SDA_S
  Top 0.406: U$3.4 R9.1 | U1.SDA 48.26,41.28 U$3.4 | U$3.4 37.13,36.2 37.07,36.14 35.62,36.14 J6.7
SELECT2_S
  Top 0.406: R25.1 67.47,61.75 67.61,61.75 68.28,61.09 C10.1 | 66.36,62.55 R25.1 | R25.1 65.88,61.75 65.74,61.75 65.47,61.48 65.47,52.13 65.33,51.99 65.33,49.45 U$17.8
TX
  Top 0.406: U$6.JP2.2 31.68,138.43 33.59,136.53 38.1,136.53 U$1.P$6
VERTICAL
  Top 0.406: U$1.P$35 J5.6
VERTICAL2_S
  Top 0.406: S2.V2 66.67,48.26 U$17.9
VERTICAL_S  (via drill 1)
  Top 0.406: S1.V2 13.26,42.62 13.26,38.18 20.96,30.48 v24.77,30.48 | J7.6 58.42,34.29 54.61,30.48 v49.53,30.48
  Route15 0.406: v49.53,30.48 v24.77,30.48
VIN
  Top 0.305: 29.21,115.57 R13.2 29.37,115.41
  Top 0.406: K6.11 54.47,93.21 42.52,93.21 41.69,94.03 28.59,94.03 26.18,96.44 26.18,103.59 27.22,104.63 27.77,104.63 30.92,107.78 30.92,113.83 29.53,115.22 R13.2 | U$18.IN+ 8.22,114.26 28.22,114.26 29.37,115.41
VIN_PIN
  Top 0.305: 31.58,115.57 R13.1
  Top 0.406: U$1.P$12 37.53,120.02 36.26,118.75 33.59,118.75 32.84,118 32.84,116.98 R13.1 30.64,116.36 30.64,116.51 30.37,116.78 28.69,116.78 27.48,115.57 D5.A
(copper drawn outside any net)
  shapes: Route2 area x8

### Text on the board
Route15: RELAY | SILNIK